# EAGLE board 68030-TK-V09g (EAGLE 6.6.0), part 1 of 2
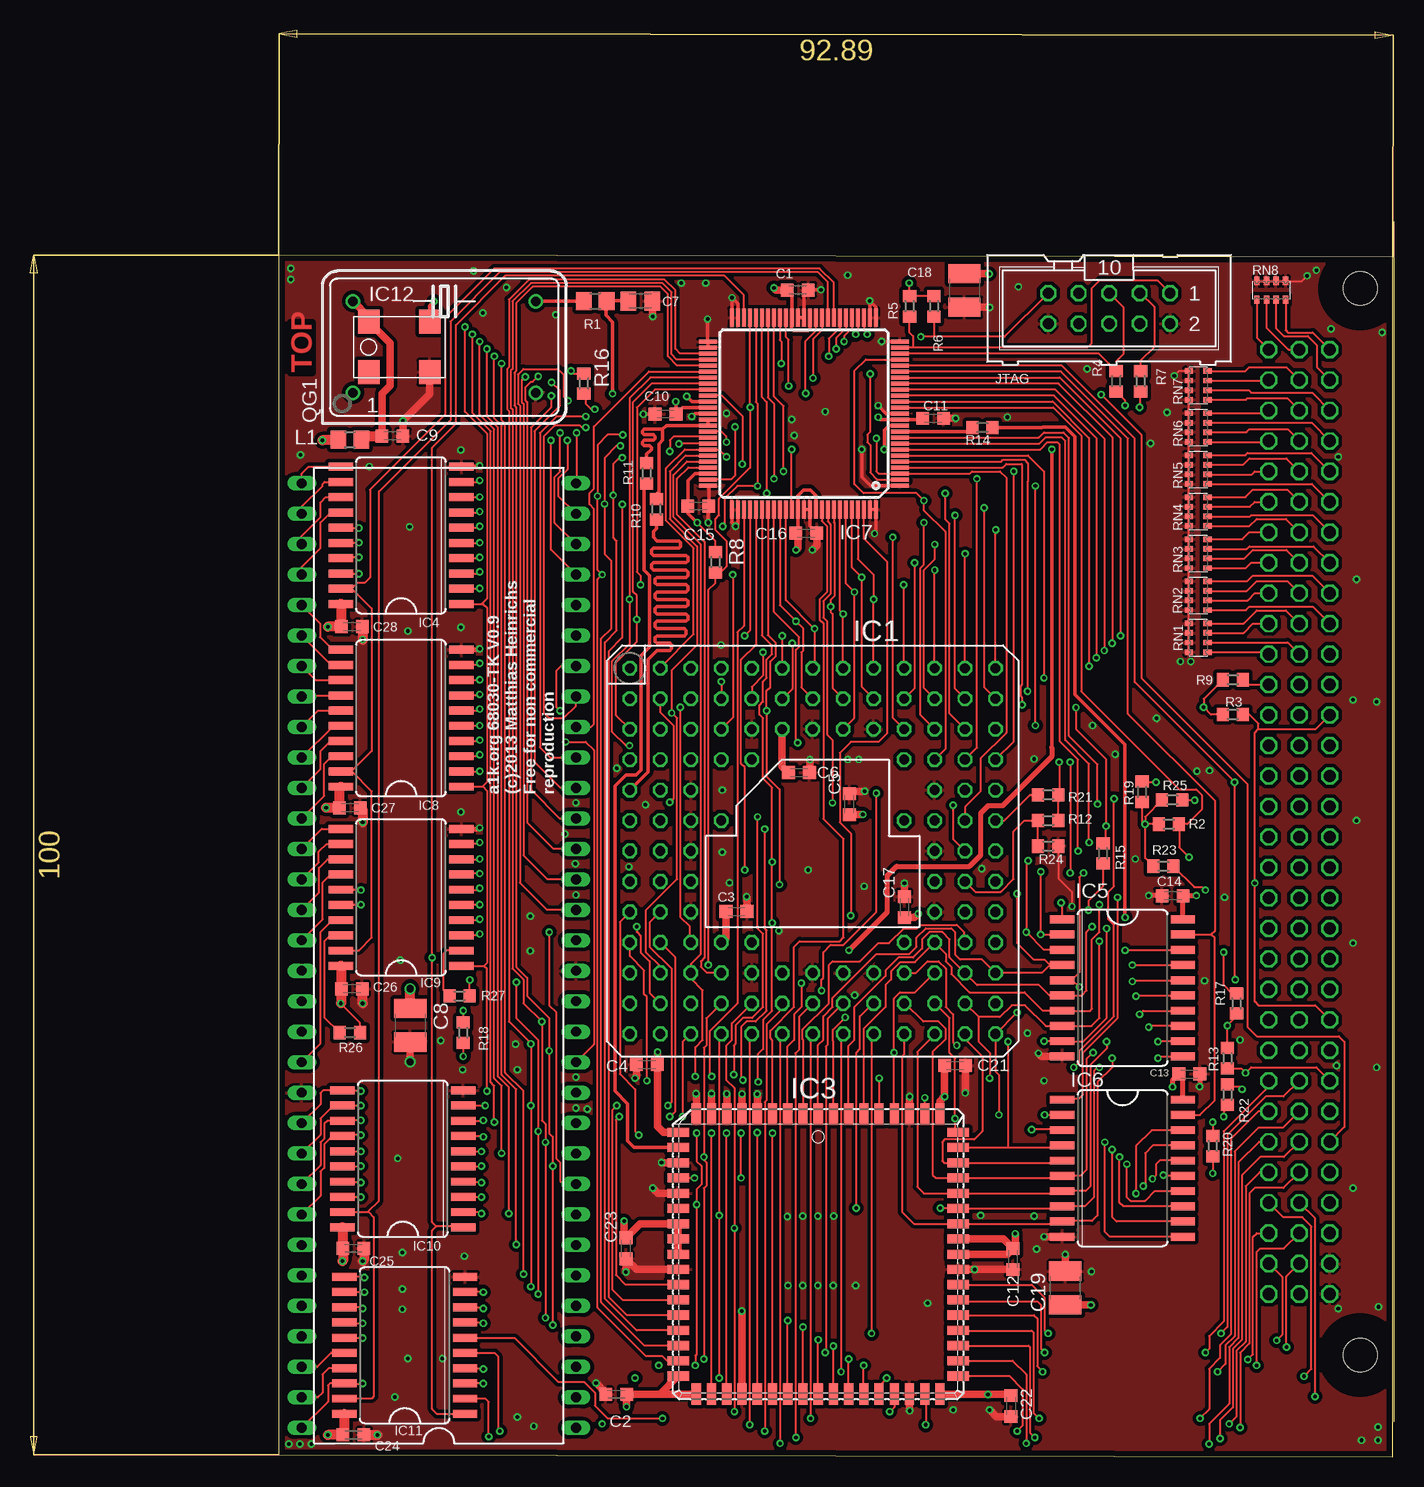
[diagram p3: board, top side]
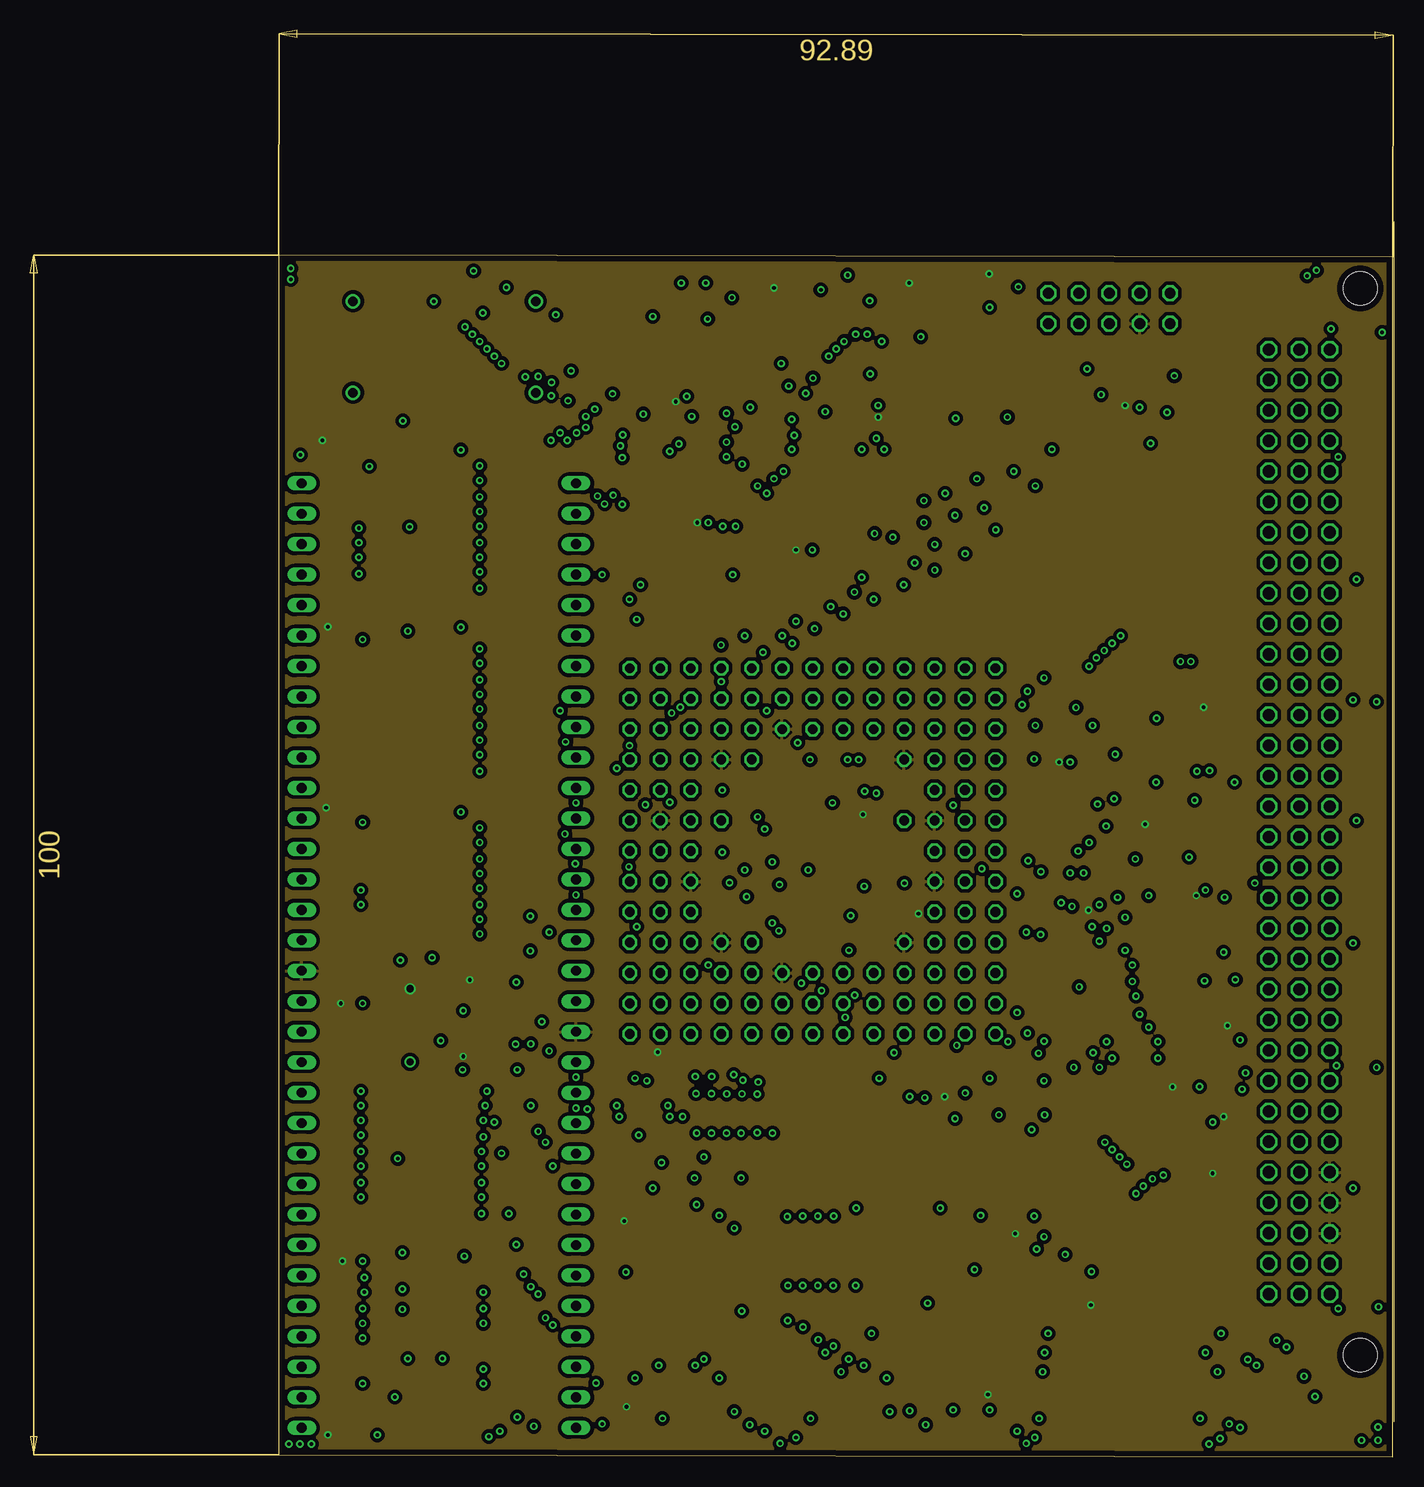
[diagram p4: board, inner layer Route2]
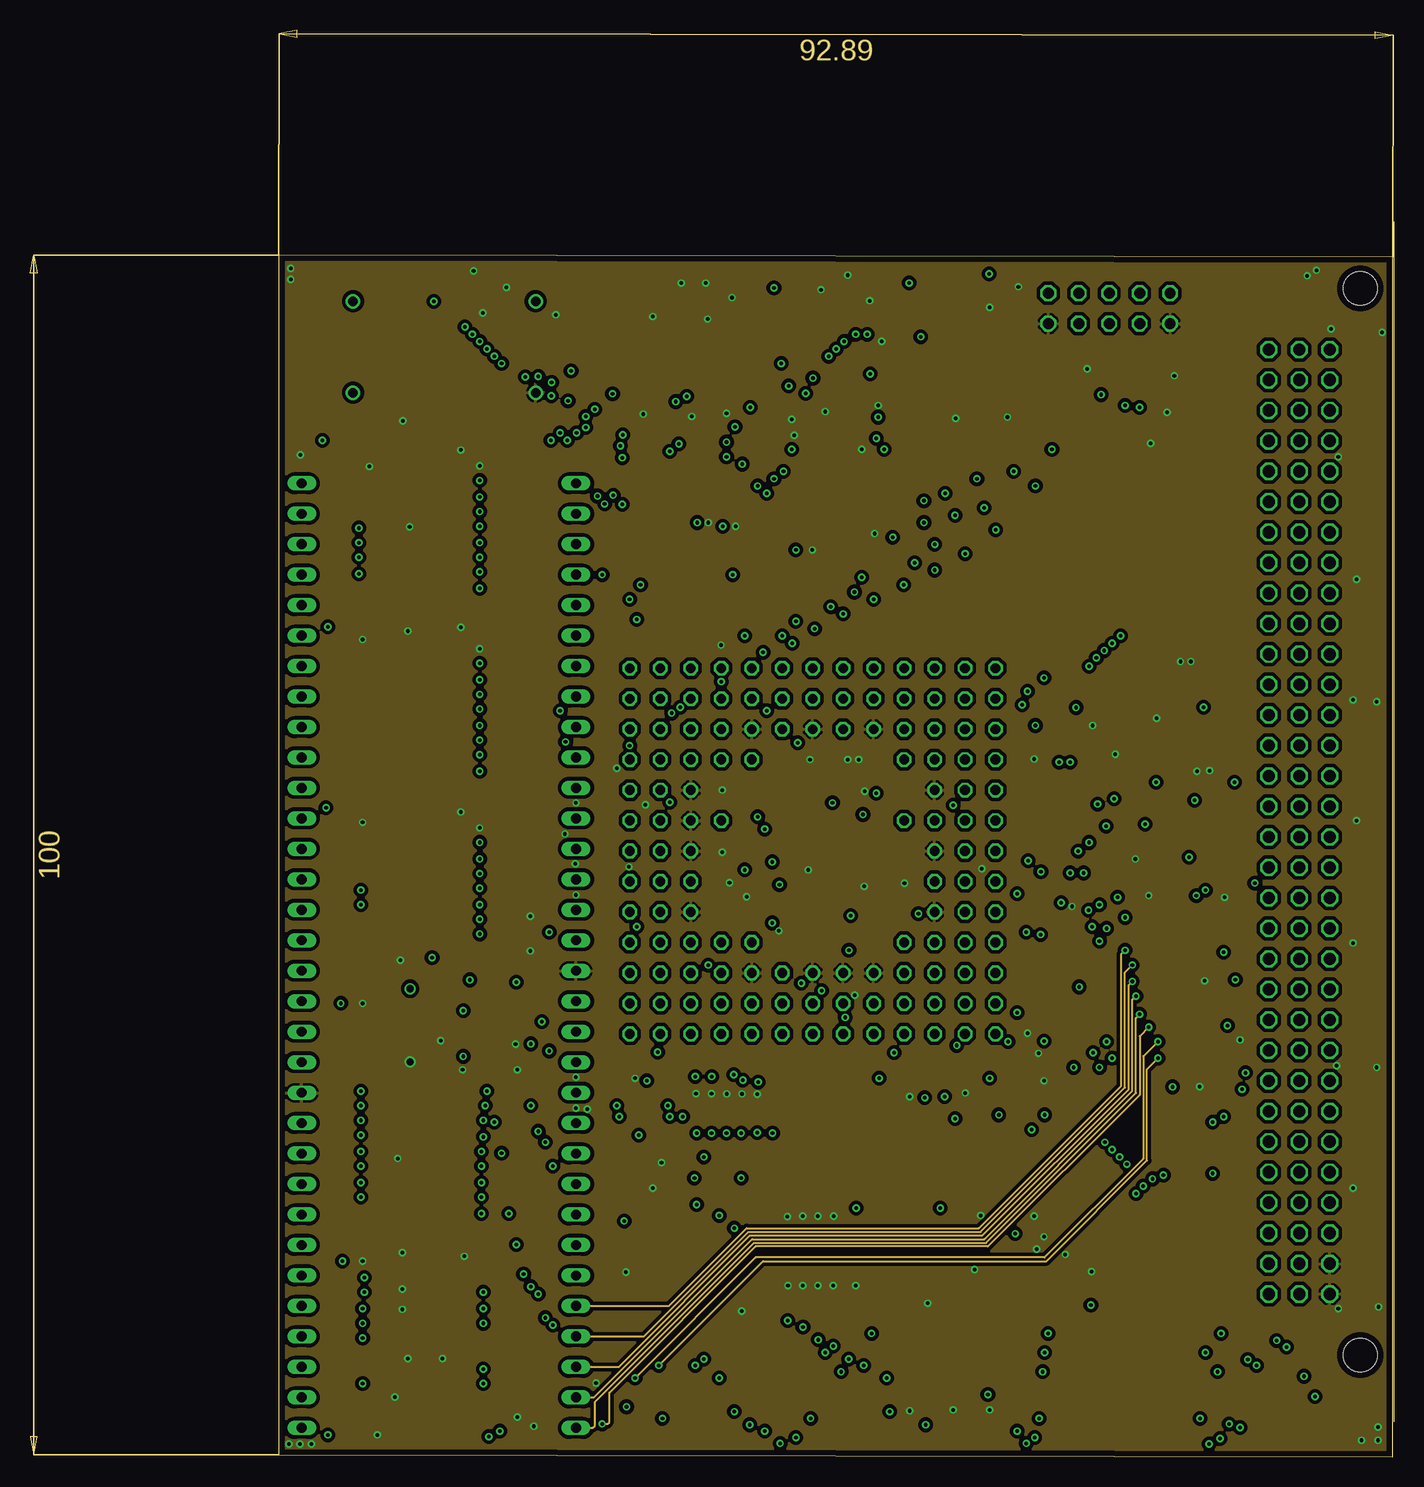
[diagram p5: board, inner layer Route15]
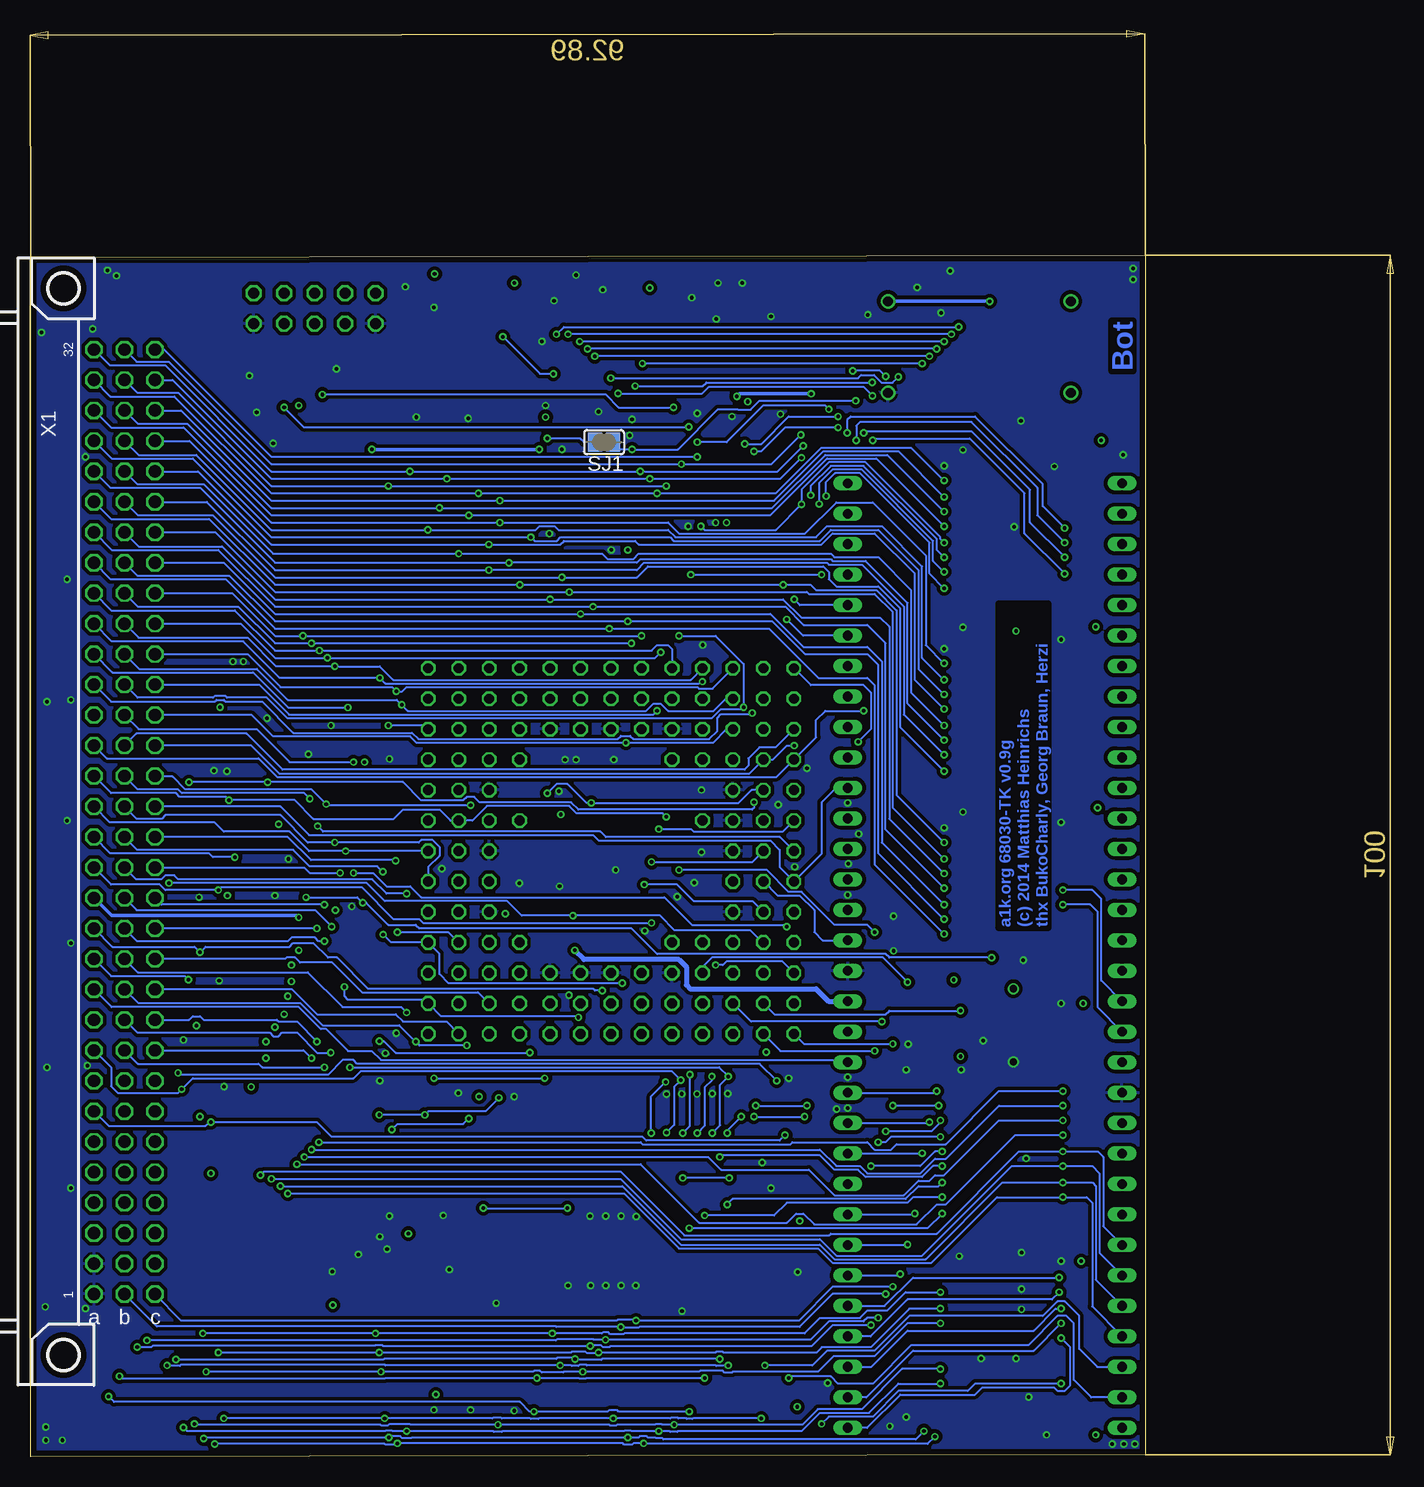
[diagram p6: board, bottom side, seen from below]

Size 92.89 x 100.15 mm. Coordinates in mm from the lower left corner, seen from the top.
Outline: 0,0.15 92.89,0 92.89,100 0,100.15 0,0.15
Copper layers (1+2*15+16): Top 0.035mm / dielectric 0.36mm / Route2 0.035mm / dielectric 0.71mm / Route15 0.035mm / dielectric 0.36mm / Bottom 0.035mm
Design rules "Eagle-DRU - 1203 - LeitOn - 04 layers *": minimum track width 6mil, minimum drill 0.3mm, track to track 6mil, track to pad 6mil, pad to pad 6mil, via to via 6mil, smd to smd 6mil, copper to edge 20mil, drill to drill 10mil, minimum pad ring 8mil, minimum via ring 6mil, stop-mask expansion 3mil, vias tented up to drill 12mil, thermal gap 8mil

## Footprints (pad centres in the part's own frame; a part is rotated, then mirrored left to right if it is on the bottom)
C0603K = smd 1.05 x 1.08: 1 -0.875,0; 2 0.875,0
C0805K = smd 1.3 x 1.6: 1 -1,0; 2 1,0
C1210 = smd 1.6 x 2.7: 1 -1.4,0; 2 1.4,0
MPGA128 = drill 0.813 octagon: A01 -15.24,15.24; A02 -12.7,15.24; A03 -10.16,15.24; A04 -7.62,15.24; A05 -5.08,15.24; A06 -2.54,15.24; A07 0,15.24; A08 2.54,15.24; A09 5.08,15.24; A10 7.62,15.24; A11 10.16,15.24; A12 12.7,15.24; A13 15.24,15.24; B01 -15.24,12.7; B02 -12.7,12.7; B03 -10.16,12.7; B04 -7.62,12.7; B05 -5.08,12.7; B06 -2.54,12.7; B07 0,12.7; B08 2.54,12.7; B09 5.08,12.7; B10 7.62,12.7; B11 10.16,12.7; B12 12.7,12.7; B13 15.24,12.7; C01 -15.24,10.16; C02 -12.7,10.16; C03 -10.16,10.16; C04 -7.62,10.16; C05 -5.08,10.16; C06 -2.54,10.16; C07 0,10.16; C08 2.54,10.16; C09 5.08,10.16; C10 7.62,10.16; C11 10.16,10.16; C12 12.7,10.16; C13 15.24,10.16; D01 -15.24,7.62; D02 -12.7,7.62; D03 -10.16,7.62; D04 -7.62,7.62; D05 -5.08,7.62; D10 7.62,7.62; D11 10.16,7.62; D12 12.7,7.62; D13 15.24,7.62; E01 -15.24,5.08; E02 -12.7,5.08; E03 -10.16,5.08; E11 10.16,5.08; E12 12.7,5.08; E13 15.24,5.08; F01 -15.24,2.54; F02 -12.7,2.54; F03 -10.16,2.54; F04 -7.62,2.54; F10 7.62,2.54; F11 10.16,2.54; F12 12.7,2.54; F13 15.24,2.54; G01 -15.24,0; G02 -12.7,0; G03 -10.16,0; G11 10.16,0; G12 12.7,0; G13 15.24,0; H01 -15.24,-2.54; H02 -12.7,-2.54; H03 -10.16,-2.54; H11 10.16,-2.54; H12 12.7,-2.54; H13 15.24,-2.54; J01 -15.24,-5.08; J02 -12.7,-5.08; J03 -10.16,-5.08; J11 10.16,-5.08; J12 12.7,-5.08; J13 15.24,-5.08; K01 -15.24,-7.62; K02 -12.7,-7.62; K03 -10.16,-7.62; K04 -7.62,-7.62; K05 -5.08,-7.62; K10 7.62,-7.62; K11 10.16,-7.62; K12 12.7,-7.62; K13 15.24,-7.62; L01 -15.24,-10.16; L02 -12.7,-10.16; L03 -10.16,-10.16; L04 -7.62,-10.16; L05 -5.08,-10.16; L06 -2.54,-10.16; L07 0,-10.16; L08 2.54,-10.16; L09 5.08,-10.16; L10 7.62,-10.16; L11 10.16,-10.16; L12 12.7,-10.16; L13 15.24,-10.16; M01 -15.24,-12.7; M02 -12.7,-12.7; M03 -10.16,-12.7; M04 -7.62,-12.7; M05 -5.08,-12.7; M06 -2.54,-12.7; M07 0,-12.7; M08 2.54,-12.7; M09 5.08,-12.7; M10 7.62,-12.7; M11 10.16,-12.7; M12 12.7,-12.7; M13 15.24,-12.7; N01 -15.24,-15.24; N02 -12.7,-15.24; N03 -10.16,-15.24; N04 -7.62,-15.24; N05 -5.08,-15.24; N06 -2.54,-15.24; N07 0,-15.24; N08 2.54,-15.24; N09 5.08,-15.24; N10 7.62,-15.24; N11 10.16,-15.24; N12 12.7,-15.24; N13 15.24,-15.24
DIL64 = drill 0.813 long: 1 -39.37,-11.43; 2 -36.83,-11.43; 3 -34.29,-11.43; 4 -31.75,-11.43; 5 -29.21,-11.43; 6 -26.67,-11.43; 7 -24.13,-11.43; 8 -21.59,-11.43; 9 -19.05,-11.43; 10 -16.51,-11.43; 11 -13.97,-11.43; 12 -11.43,-11.43; 13 -8.89,-11.43; 14 -6.35,-11.43; 15 -3.81,-11.43; 16 -1.27,-11.43; 17 1.27,-11.43; 18 3.81,-11.43; 19 6.35,-11.43; 20 8.89,-11.43; 21 11.43,-11.43; 22 13.97,-11.43; 23 16.51,-11.43; 24 19.05,-11.43; 25 21.59,-11.43; 26 24.13,-11.43; 27 26.67,-11.43; 28 29.21,-11.43; 29 31.75,-11.43; 30 34.29,-11.43; 31 36.83,-11.43; 32 39.37,-11.43; 33 39.37,11.43; 34 36.83,11.43; 35 34.29,11.43; 36 31.75,11.43; 37 29.21,11.43; 38 26.67,11.43; 39 24.13,11.43; 40 21.59,11.43; 41 19.05,11.43; 42 16.51,11.43; 43 13.97,11.43; 44 11.43,11.43; 45 8.89,11.43; 46 6.35,11.43; 47 3.81,11.43; 48 1.27,11.43; 49 -1.27,11.43; 50 -3.81,11.43; 51 -6.35,11.43; 52 -8.89,11.43; 53 -11.43,11.43; 54 -13.97,11.43; 55 -16.51,11.43; 56 -19.05,11.43; 57 -21.59,11.43; 58 -24.13,11.43; 59 -26.67,11.43; 60 -29.21,11.43; 61 -31.75,11.43; 62 -34.29,11.43; 63 -36.83,11.43; 64 -39.37,11.43
PLCC68 = smd 0.76 x 1.8: 1 0,11.67; 2 -1.27,11.67; 3 -2.54,11.67; 4 -3.81,11.67; 5 -5.08,11.67; 6 -6.35,11.67; 7 -7.62,11.67; 8 -8.89,11.67; 9 -10.16,11.67; 27 -10.16,-11.67; 28 -8.89,-11.67; 29 -7.62,-11.67; 30 -6.35,-11.67; 31 -5.08,-11.67; 32 -3.81,-11.67; 33 -2.54,-11.67; 34 -1.27,-11.67; 35 0,-11.67; 36 1.27,-11.67; 37 2.54,-11.67; 38 3.81,-11.67; 39 5.08,-11.67; 40 6.35,-11.67; 41 7.62,-11.67; 42 8.89,-11.67; 43 10.16,-11.67; 61 10.16,11.67; 62 8.89,11.67; 63 7.62,11.67; 64 6.35,11.67; 65 5.08,11.67; 66 3.81,11.67; 67 2.54,11.67; 68 1.27,11.67 | smd 1.8 x 0.76: 10 -11.67,10.16; 11 -11.67,8.89; 12 -11.67,7.62; 13 -11.67,6.35; 14 -11.67,5.08; 15 -11.67,3.81; 16 -11.67,2.54; 17 -11.67,1.27; 18 -11.67,0; 19 -11.67,-1.27; 20 -11.67,-2.54; 21 -11.67,-3.81; 22 -11.67,-5.08; 23 -11.67,-6.35; 24 -11.67,-7.62; 25 -11.67,-8.89; 26 -11.67,-10.16; 44 11.67,-10.16; 45 11.67,-8.89; 46 11.67,-7.62; 47 11.67,-6.35; 48 11.67,-5.08; 49 11.67,-3.81; 50 11.67,-2.54; 51 11.67,-1.27; 52 11.67,0; 53 11.67,1.27; 54 11.67,2.54; 55 11.67,3.81; 56 11.67,5.08; 57 11.67,6.35; 58 11.67,7.62; 59 11.67,8.89; 60 11.67,10.16
SO20W = smd 0.66 x 2.032: 1 -5.715,-5.029; 2 -4.445,-5.029; 3 -3.175,-5.029; 4 -1.905,-5.029; 5 -0.635,-5.029; 6 0.635,-5.029; 7 1.905,-5.029; 8 3.175,-5.029; 9 4.445,-5.029; 10 5.715,-5.029; 11 5.715,5.029; 12 4.445,5.029; 13 3.175,5.029; 14 1.905,5.029; 15 0.635,5.029; 16 -0.635,5.029; 17 -1.905,5.029; 18 -3.175,5.029; 19 -4.445,5.029; 20 -5.715,5.029
TQFP100 = smd 1.5 x 0.342: 1 -8,6; 2 -8,5.5; 3 -8,5; 4 -8,4.5; 5 -8,4; 6 -8,3.5; 7 -8,3; 8 -8,2.5; 9 -8,2; 10 -8,1.5; 11 -8,1; 12 -8,0.5; 13 -8,0; 14 -8,-0.5; 15 -8,-1; 16 -8,-1.5; 17 -8,-2; 18 -8,-2.5; 19 -8,-3; 20 -8,-3.5; 21 -8,-4; 22 -8,-4.5; 23 -8,-5; 24 -8,-5.5; 25 -8,-6; 51 8,-6; 52 8,-5.5; 53 8,-5; 54 8,-4.5; 55 8,-4; 56 8,-3.5; 57 8,-3; 58 8,-2.5; 59 8,-2; 60 8,-1.5; 61 8,-1; 62 8,-0.5; 63 8,0; 64 8,0.5; 65 8,1; 66 8,1.5; 67 8,2; 68 8,2.5; 69 8,3; 70 8,3.5; 71 8,4; 72 8,4.5; 73 8,5; 74 8,5.5; 75 8,6 | smd 0.342 x 1.5: 26 -6,-8; 27 -5.5,-8; 28 -5,-8; 29 -4.5,-8; 30 -4,-8; 31 -3.5,-8; 32 -3,-8; 33 -2.5,-8; 34 -2,-8; 35 -1.5,-8; 36 -1,-8; 37 -0.5,-8; 38 0,-8; 39 0.5,-8; 40 1,-8; 41 1.5,-8; 42 2,-8; 43 2.5,-8; 44 3,-8; 45 3.5,-8; 46 4,-8; 47 4.5,-8; 48 5,-8; 49 5.5,-8; 50 6,-8; 76 6,8; 77 5.5,8; 78 5,8; 79 4.5,8; 80 4,8; 81 3.5,8; 82 3,8; 83 2.5,8; 84 2,8; 85 1.5,8; 86 1,8; 87 0.5,8; 88 0,8; 89 -0.5,8; 90 -1,8; 91 -1.5,8; 92 -2,8; 93 -2.5,8; 94 -3,8; 95 -3.5,8; 96 -4,8; 97 -4.5,8; 98 -5,8; 99 -5.5,8; 100 -6,8
7X5 = smd 1.8 x 2: P$1 -2.54,-2.1; P$2 2.54,-2.1; P$3 2.54,2.1; P$4 -2.54,2.1
R0805 = smd 1.3 x 1.5: 1 -0.95,0; 2 0.95,0
DIL14S = drill 0.813: 1 -7.62,-3.81; 7 7.62,-3.81; 8 7.62,3.81; 14 -7.62,3.81
R0603 = smd 1 x 1.1: 1 -0.85,0; 2 0.85,0
EXBV8V = smd 0.45 x 0.7: 1 -1.2,-0.775; 2 -0.4,-0.775; 3 0.4,-0.775; 4 1.2,-0.775; 5 1.2,0.775; 6 0.4,0.775; 7 -0.4,0.775; 8 -1.2,0.775
SJ = smd 1.168 x 1.6: 1 -0.762,0; 2 0.762,0
ML10 = drill 0.914 octagon: 1 -5.08,-1.27; 2 -5.08,1.27; 3 -2.54,-1.27; 4 -2.54,1.27; 5 0,-1.27; 6 0,1.27; 7 2.54,-1.27; 8 2.54,1.27; 9 5.08,-1.27; 10 5.08,1.27
FABC96R = drill 1.016 octagon: A1 -2.54,39.37; A2 -2.54,36.83; A3 -2.54,34.29; A4 -2.54,31.75; A5 -2.54,29.21; A6 -2.54,26.67; A7 -2.54,24.13; A8 -2.54,21.59; A9 -2.54,19.05; A10 -2.54,16.51; A11 -2.54,13.97; A12 -2.54,11.43; A13 -2.54,8.89; A14 -2.54,6.35; A15 -2.54,3.81; A16 -2.54,1.27; A17 -2.54,-1.27; A18 -2.54,-3.81; A19 -2.54,-6.35; A20 -2.54,-8.89; A21 -2.54,-11.43; A22 -2.54,-13.97; A23 -2.54,-16.51; A24 -2.54,-19.05; A25 -2.54,-21.59; A26 -2.54,-24.13; A27 -2.54,-26.67; A28 -2.54,-29.21; A29 -2.54,-31.75; A30 -2.54,-34.29; A31 -2.54,-36.83; A32 -2.54,-39.37; B1 -5.08,39.37; B2 -5.08,36.83; B3 -5.08,34.29; B4 -5.08,31.75; B5 -5.08,29.21; B6 -5.08,26.67; B7 -5.08,24.13; B8 -5.08,21.59; B9 -5.08,19.05; B10 -5.08,16.51; B11 -5.08,13.97; B12 -5.08,11.43; B13 -5.08,8.89; B14 -5.08,6.35; B15 -5.08,3.81; B16 -5.08,1.27; B17 -5.08,-1.27; B18 -5.08,-3.81; B19 -5.08,-6.35; B20 -5.08,-8.89; B21 -5.08,-11.43; B22 -5.08,-13.97; B23 -5.08,-16.51; B24 -5.08,-19.05; B25 -5.08,-21.59; B26 -5.08,-24.13; B27 -5.08,-26.67; B28 -5.08,-29.21; B29 -5.08,-31.75; B30 -5.08,-34.29; B31 -5.08,-36.83; B32 -5.08,-39.37; C1 -7.62,39.37; C2 -7.62,36.83; C3 -7.62,34.29; C4 -7.62,31.75; C5 -7.62,29.21; C6 -7.62,26.67; C7 -7.62,24.13; C8 -7.62,21.59; C9 -7.62,19.05; C10 -7.62,16.51; C11 -7.62,13.97; C12 -7.62,11.43; C13 -7.62,8.89; C14 -7.62,6.35; C15 -7.62,3.81; C16 -7.62,1.27; C17 -7.62,-1.27; C18 -7.62,-3.81; C19 -7.62,-6.35; C20 -7.62,-8.89; C21 -7.62,-11.43; C22 -7.62,-13.97; C23 -7.62,-16.51; C24 -7.62,-19.05; C25 -7.62,-21.59; C26 -7.62,-24.13; C27 -7.62,-26.67; C28 -7.62,-29.21; C29 -7.62,-31.75; C30 -7.62,-34.29; C31 -7.62,-36.83; C32 -7.62,-39.37 | hole 2.794: 0,-44.456; 0,44.456

## Placement (x,y rotation side)
C1  100nF  [C0603K]  43.28,97.26 0 top
C2  100nF  [C0603K]  28.14,5.21 180 top
C3  100nF  [C0603K]  38.18,45.44 0 top
C4  100nF  [C0603K]  30.71,32.69 180 top
C5  100nF  [C0603K]  47.57,54.41 90 top
C6  100nF  [C0603K]  43.38,57.02 0 top
C7  n.b.  [C0805K]  30.15,96.34 0 top
C8  10µF  [C1210]  10.97,35.97 270 top
C9  100nF  [C0603K]  9.5,85.09 0 top
C10  100nF  [C0603K]  32.26,86.92 180 top
C11  100nF  [C0603K]  54.56,86.56 0 top
C12  100nF  [C0603K]  61.21,16.48 270 top
C13  100nF  [C0603K]  75.92,31.9 0 top
C14  100nF  [C0603K]  74.52,46.76 180 top
C15  100nF  [C0603K]  35,79.25 0 top
C16  100nF  [C0603K]  43.99,76.99 0 top
C17  100nF  [C0603K]  52.17,45.82 90 top
C18  10µF  [C1210]  57.18,97.23 270 top
C19  10µF  [C1210]  65.58,14.07 90 top
C21  100nF  [C0603K]  56.39,32.61 0 top
C22  100nF  [C0603K]  61.06,4.22 270 top
C23  100nF  [C0603K]  28.96,17.37 270 top
C24  100nF  [C0603K]  6.25,1.83 0 top
C25  100nF  [C0603K]  6.25,17.37 0 top
C26  100nF  [C0603K]  6.1,39.01 0 top
C27  100nF  [C0603K]  5.94,54.1 0 top
C28  100nF  [C0603K]  6.1,69.19 0 top
IC1  [MPGA128]  44.53,50.49 0 top
IC2  [DIL64]  13.36,41.78 90 top
IC3  [PLCC68]  44.98,16.89 0 top
IC4  74HCT245DW  [SO20W]  10.21,76.81 90 top
IC5  74HCT245DW  [SO20W]  70.36,39.09 270 top
IC6  74HCT245DW  [SO20W]  70.36,24.05 270 top
IC7  [TQFP100]  43.79,86.97 180 top
IC8  74HCT245DW  [SO20W]  10.21,61.57 90 top
IC9  74HCT245DW  [SO20W]  10.21,46.63 90 top
IC10  74HCT245DW  [SO20W]  10.36,24.84 90 top
IC11  74HCT245DW  [SO20W]  10.52,9.3 90 top
IC12  100Mhz  [7X5]  10.06,92.51 0 top
L1  [R0805]  5.94,84.78 0 top
QG1  100Mhz  [DIL14S]  13.82,92.51 0 top
R1  10  [R0805]  26.39,96.34 0 top
R2  4,7k  [R0603]  74.22,52.73 180 top
R3  4,7k  [R0603]  79.55,61.87 0 top
R4  4,7k  [R0603]  69.82,89.66 270 top
R5  4,7k  [R0603]  52.6,95.91 90 top
R6  4,7k  [R0603]  54.64,95.91 90 top
R7  47  [R0603]  71.86,89.66 270 top
R8  4,7k  [R0603]  36.42,74.57 270 top
R9  4,7k  [R0603]  79.55,64.77 0 top
R10  47  [R0603]  31.5,78.97 270 top
R11  47  [R0603]  30.68,81.97 270 top
R12  4,7k  [R0603]  64.16,53.03 0 top
R13  4,7k  [R0603]  79.1,33.22 90 top
R14  47  [R0603]  58.67,85.8 180 top
R15  4,7k  [R0603]  68.73,50.29 270 top
R16  47  [R0603]  25.45,89.46 90 top
R17  4,7k  [R0603]  79.86,37.79 90 top
R18  4,7k  [R0603]  15.39,35.36 90 top
R19  4,7k  [R0603]  71.98,55.42 90 top
R20  4,7k  [R0603]  77.88,25.91 270 top
R21  4,7k  [R0603]  64.16,55.17 0 top
R22  4,7k  [R0603]  79.1,30.17 90 top
R23  4,7k  [R0603]  73.76,49.22 0 top
R24  4,7k  [R0603]  64.16,50.9 0 top
R25  4,7k  [R0603]  74.5,54.76 0 top
R26  4,7K  [R0603]  5.94,35.36 0 top
R27  4,7K  [R0603]  15.09,38.4 180 top
RN1  4,7k  [EXBV8V]  76.66,68.27 90 top
RN2  4,7k  [EXBV8V]  76.66,71.78 90 top
RN3  4,7k  [EXBV8V]  76.66,75.29 90 top
RN4  4,7k  [EXBV8V]  76.66,78.79 90 top
RN5  4,7k  [EXBV8V]  76.66,82.3 90 top
RN6  4,7k  [EXBV8V]  76.66,85.8 90 top
RN7  4,7k  [EXBV8V]  76.66,89.31 90 top
RN8  4,7k  [EXBV8V]  82.75,97.23 0 top
SJ1  [SJ]  45.11,84.58 180 bottom
SV1  [ML10]  69.24,95.73 180 top
X1  FABC96R  [FABC96R]  90.17,52.93 180 bottom

## Tracks (layer width: path | path; a pad name or v marks a point on that pad's centre or on a via)
!FPU_SENSE
  Top 0.152: IC3.4 41.17,34.72 41,34.9 41,35.51 42.98,37.49 42.98,42.52 43.43,42.98 46.79,42.98 47.09,43.28 47.09,51.51 45.41,53.19 45.41,69.49 45.11,69.8 45.11,71.47 45.72,72.09 45.72,77.57 45.29,78 IC7.91
A0  (via drill 0.3)
  Top 0.152: IC1.A02 31.83,65.81 34.59,68.58 34.59,75.74 32.31,78.03 32.31,82.4 33.88,83.97 IC7.69 36.73,83.97 v37.34,83.36 37.08,83.62 | RN8.1 81.55,93.3 X1.C32
  Bottom 0.152: X1.C32 81.79,92.3 72.85,83.36 v37.34,83.36
A1  (via drill 0.3)
  Top 0.152: v38.66,82.75 38.66,86.77 36.96,88.47 IC7.60 | v37.87,73.53 37.87,61.62 IC1.C04 | v28.7,85.19 27.43,85.19 26.59,84.35 v26.59,80.09 26.59,73.91 v26.98,73.53 26.59,73.15 26.59,12.42 30.63,8.38 32,8.38 32.38,8 IC3.25 | IC4.2 16.74,72.36 v16.76,72.39 | RN8.2 82.35,94.13 84.18,92.3 X1.B32
  Bottom 0.152: X1.B32 84.07,91.29 81.38,91.29 72.85,82.75 v38.66,82.75 31.14,82.75 v28.7,85.19 | v37.87,73.53 v26.98,73.53 | v16.76,72.39 17.98,73.61 17.98,76.2 23.77,81.99 25.86,81.99 26.59,81.25 v26.59,80.09
A2  (via drill 0.3)
  Top 0.152: v61.29,82.14 61.29,59.64 IC1.D13 | IC3.24 30.5,9.27 26.9,12.88 26.9,68.2 27.74,69.04 27.74,74.68 27.18,75.23 v27.18,79.42 27.18,83.26 28.19,84.28 v28.5,84.28 | v42.09,82.14 42.09,87.6 41.3,88.39 41.3,94.96 IC7.43 | IC4.3 16.64,73.63 v16.76,73.76 | RN8.4 83.95,93.9 84.12,93.73 86.21,93.73 X1.A32
  Bottom 0.152: X1.A32 86.31,90.98 81.69,90.98 72.85,82.14 v61.29,82.14 v42.09,82.14 30.63,82.14 v28.5,84.28 | v16.76,73.76 17.68,74.68 17.68,76.35 23.62,82.3 26.06,82.3 27.18,81.18 v27.18,79.42
A3  (via drill 0.3)
  Top 0.152: IC3.23 29.84,10.54 27.2,13.18 27.2,67.89 28.19,68.88 28.19,76.35 27.89,76.66 v27.89,80.16 27.89,82.75 28.42,83.29 v28.65,83.29 | IC1.D12 58.22,59.11 v58.22,81.53 | IC7.44 40.79,88.29 41.3,87.78 v41.3,81.53 | IC4.4 16.69,74.9 v16.76,74.98 | RN7.3 82.49,89.71 X1.C31
  Bottom 0.152: X1.C31 81.08,89.76 72.85,81.53 v58.22,81.53 v41.3,81.53 30.4,81.53 v28.65,83.29 | v16.76,74.98 17.37,75.59 17.37,76.5 23.47,82.6 26.21,82.6 27.89,80.92 v27.89,80.16
A4  (via drill 0.3)
  Top 0.152: IC3.22 29.03,11.81 27.51,13.33 27.51,67.13 28.65,68.28 v28.65,79.4 | v63.09,60.96 v63.09,80.92 | IC4.5 16.74,76.17 v16.76,76.2 | IC7.46 39.79,87.92 39.93,87.78 v39.93,80.92 38.25,80.92 37.19,79.86 37.19,77.72 v37.03,77.57 | RN7.4 80.6,90.51 80.92,90.83 84.02,90.83 X1.B31
  Bottom 0.152: X1.B31 84.02,88.7 80.62,88.7 72.85,80.92 v63.09,80.92 v39.93,80.92 | IC1.C13 60.07,60.96 v63.09,60.96 | v16.76,76.2 17.07,76.5 17.07,76.66 23.32,82.91 26.36,82.91 28.65,80.62 v28.65,79.4 30.79,77.27 36.73,77.27 v37.03,77.57
A5  (via drill 0.3)
  Top 0.152: IC1.C12 55.93,61.95 55.93,77.77 55.58,78.13 v55.58,80.31 | v40.69,80.31 40.69,87.93 40.29,88.34 IC7.45 | IC4.9 16.64,81.25 v16.76,81.38 | RN8.3 83.15,94.09 83.82,93.42 85.8,93.42 86.56,92.66 86.56,90.83 X1.A31
  Bottom 0.152: X1.A31 86.26,88.39 80.92,88.39 72.85,80.31 v55.58,80.31 v40.69,80.31 30.79,80.31 26.98,84.12 19.51,84.12 v16.76,81.38
A6  (via drill 0.3)
  Top 0.152: IC1.D11 55.63,59.05 55.63,77.11 55.58,77.11 53.8,78.89 v53.8,79.7 53.19,80.31 48.77,80.31 48.01,81.08 48.01,90.53 48.95,91.47 IC7.22 | IC4.8 16.74,79.98 v16.76,80.01 | RN6.4 82.33,87 X1.C30
  Bottom 0.152: X1.C30 80.37,87.22 72.85,79.7 v53.8,79.7 30.94,79.7 26.82,83.82 20.57,83.82 v16.76,80.01
A7  (via drill 0.3)
  Top 0.152: IC1.B13 58.83,64.13 v58.83,79.09 | IC4.7 16.69,78.71 v16.76,78.79 | X1.B30 84.07,88.24 80.77,88.24 80.64,88.11 RN7.1
  Bottom 0.152: X1.B30 83.97,86.11 79.86,86.11 72.85,79.09 v58.83,79.09 31.09,79.09 26.67,83.52 21.49,83.52 v16.76,78.79
A8  (via drill 0.3)
  Top 0.152: IC1.B12 56.39,64.03 v56.39,78.49 | IC4.6 16.64,77.44 v16.76,77.57 | RN7.2 80.87,88.91 81.08,88.7 86.16,88.7 X1.A30
  Bottom 0.152: X1.A30 86.21,85.8 80.16,85.8 72.85,78.49 v56.39,78.49 31.24,78.49 26.52,83.21 22.4,83.21 v16.76,77.57
A9  (via drill 0.3)
  Top 0.152: IC1.C11 53.49,61.85 53.49,74.07 53.8,74.37 v53.8,77.88 | v16.76,66.14 16.64,66.01 IC8.9 | RN6.1 82.47,84.6 X1.C29
  Bottom 0.152: X1.C29 79.65,84.68 72.85,77.88 v53.8,77.88 39.78,77.88 38.86,76.96 28.35,76.96 25.76,79.55 22.71,79.55 18.29,75.13 18.29,67.67 v16.76,66.14
A10  (via drill 0.3)
  Top 0.152: IC1.A13 59.77,77.24 v59.79,77.27 | IC8.8 16.74,64.74 v16.76,64.77 | RN6.2 80.68,85.4 80.92,85.65 84.12,85.65 X1.B29
  Bottom 0.152: X1.B29 83.92,83.52 79.1,83.52 72.85,77.27 v59.79,77.27 50.8,77.27 50.49,77.57 49.23,77.57 48.92,77.27 39.78,77.27 39.17,76.66 27.43,76.66 26.52,77.57 21.95,77.57 18.59,74.22 18.59,66.6 v16.76,64.77
A11  (via drill 0.3)
  Top 0.152: IC1.C10 51.21,61.59 v51.21,76.66 | v16.76,63.55 16.69,63.47 IC8.7 | RN6.3 86.11,86.2 X1.A29
  Bottom 0.152: X1.A29 86.16,83.21 79.4,83.21 72.85,76.66 v51.21,76.66 50.9,76.35 49.02,76.35 48.72,76.66 39.62,76.66 39.32,76.35 27.13,76.35 26.21,77.27 22.25,77.27 18.9,73.91 18.9,65.68 v16.76,63.55
A12  (via drill 0.3)
  Top 0.152: IC1.B11 53.8,64.08 53.8,73.91 54.71,74.83 v54.71,76.05 | IC8.6 16.64,62.2 v16.76,62.33 | RN5.2 81.13,81.9 81.38,82.14 X1.C28
  Bottom 0.152: X1.C28 78.94,82.14 72.85,76.05 v54.71,76.05 48.77,76.05 48.46,76.35 42.52,76.35 42.22,76.05 26.98,76.05 26.06,76.96 22.55,76.96 19.2,73.61 19.2,64.77 v16.76,62.33
A13  (via drill 0.3)
  Top 0.152: IC1.A12 v57.23,75.28 | v16.76,60.96 16.74,60.93 IC8.5 | RN5.3 80.41,82.7 80.92,83.21 84.02,83.21 X1.B28
  Bottom 0.152: X1.B28 84.02,81.08 78.49,81.08 72.69,75.28 v57.23,75.28 45.26,75.28 44.81,74.83 42.67,74.83 42.22,75.28 26.21,75.28 25.91,74.98 22.25,74.98 19.51,72.24 19.51,63.7 v16.76,60.96
A14  (via drill 0.3)
  Top 0.152: IC1.B10 53.03,64.08 v53.03,74.52 | IC8.4 16.69,59.66 v16.76,59.74 | RN5.4 80.6,83.5 80.77,83.67 86.11,83.67 X1.A28
  Bottom 0.152: X1.A28 86.26,80.77 78.79,80.77 72.54,74.52 v53.03,74.52 42.37,74.52 42.06,74.83 26.21,74.83 26.06,74.68 23.32,74.68 19.81,71.17 19.81,62.79 v16.76,59.74
A15  (via drill 0.3)
  Top 0.152: IC1.A11 54.69,73.89 v54.71,73.91 | v16.76,58.52 16.64,58.39 IC8.3 | RN4.3 80.97,79.19 81.38,79.6 X1.C27
  Bottom 0.152: X1.C27 78.23,79.6 72.54,73.91 v54.71,73.91 42.37,73.91 41.76,74.52 26.52,74.52 26.36,74.37 23.62,74.37 20.12,70.87 20.12,61.87 v16.76,58.52
A16  (via drill 0.3)
  Top 0.152: IC1.B09 48.62,64.19 v48.62,73.3 47.79,74.13 IC7.96 | IC8.2 16.74,57.12 v16.76,57.15 | RN4.4 80.6,79.99 81.23,80.62 84.07,80.62 X1.B27
  Bottom 0.152: X1.B27 83.97,78.49 77.72,78.49 72.54,73.3 v48.62,73.3 42.37,73.3 41.45,74.22 26.82,74.22 26.36,73.76 26.36,73.15 25.76,72.54 22.25,72.54 20.42,70.71 20.42,60.81 v16.76,57.15
A17  (via drill 0.3)
  Top 0.152: IC1.A10 52.12,65.76 v52.12,72.69 | IC7.59 31.36,88.97 29.87,87.48 29.87,73.76 30.18,73.46 v30.18,72.69 | v16.76,51.21 16.64,51.08 IC9.9 | RN5.1 86.14,81.1 X1.A27
  Bottom 0.152: X1.A27 86.21,78.18 78.03,78.18 72.54,72.69 v52.12,72.69 v30.18,72.69 27.89,72.69 27.43,72.24 22.4,72.24 20.73,70.56 20.73,55.17 v16.76,51.21
A18  (via drill 0.3)
  Top 0.152: IC1.C08 48.01,61.59 v48.01,72.09 47.29,72.8 IC7.95 | IC9.8 16.74,49.81 v16.76,49.83 | RN3.4 80.35,76.48 80.92,77.06 X1.C26
  Bottom 0.152: X1.C26 77.52,77.06 72.54,72.09 v48.01,72.09 28.19,72.09 28.04,71.93 22.55,71.93 21.03,70.41 21.03,54.1 v16.76,49.83
A19  (via drill 0.3)
  Top 0.152: IC1.A09 v49.61,71.47 49.61,73.53 48.29,74.85 IC7.97 | v16.76,48.62 15.32,48.62 IC9.7 | RN4.1 80.94,77.59 81.53,78.18 83.97,78.18 X1.B26
  Bottom 0.152: X1.B26 83.92,75.89 76.96,75.89 72.54,71.47 v49.61,71.47 30.18,71.47 28.65,69.95 22.1,69.95 21.34,69.19 21.34,53.19 v16.76,48.62
A20  (via drill 0.3)
  Top 0.152: IC1.B08 46.18,64.08 46.18,70.26 46.02,70.41 v46.02,70.87 46.02,71.42 46.33,71.73 46.33,77.88 46.29,77.92 IC7.93 | IC9.6 16.64,47.27 v16.76,47.4 | RN4.2 80.98,78.39 81.08,78.49 86.21,78.49 X1.A26
  Bottom 0.152: X1.A26 86.16,75.59 77.27,75.59 72.54,70.87 v46.02,70.87 30,70.87 28.47,69.34 23.16,69.34 21.64,67.82 21.64,52.27 v16.76,47.4
A21  (via drill 0.3)
  Top 0.152: IC1.A08 v47.07,70.26 46.79,70.53 IC7.94 | v16.76,46.02 16.74,46 IC9.5 | RN3.1 80.64,74.09 81.08,74.52 X1.C25
  Bottom 0.152: X1.C25 76.81,74.52 72.54,70.26 v47.07,70.26 31.24,70.26 28.5,67.51 23.16,67.51 21.95,66.29 21.95,51.21 v16.76,46.02
A22  (via drill 0.3)
  Top 0.152: IC9.4 16.69,44.73 v16.76,44.8 | IC1.B07 43.59,64.13 43.59,67.06 43.74,67.21 43.74,69.04 v43.13,69.65 41.79,70.99 IC7.84 | RN3.2 80.52,74.89 81.23,75.59 84.02,75.59 X1.B25
  Bottom 0.152: X1.B25 84.02,73.46 76.35,73.46 72.54,69.65 v43.13,69.65 31.09,69.65 28.35,66.9 23.16,66.9 22.25,65.99 22.25,50.29 v16.76,44.8
A23  (via drill 0.3)
  Top 0.152: v16.76,43.59 16.64,43.46 IC9.3 | IC1.A07 44.68,65.89 v44.68,69.04 44.65,69.04 42.29,71.4 IC7.85 | RN3.3 80.72,75.69 80.92,75.89 86.26,75.89 X1.A25
  Bottom 0.152: X1.A25 86.26,73.15 76.66,73.15 72.54,69.04 v44.68,69.04 31.37,69.04 27.25,64.92 23.16,64.92 22.55,64.31 22.55,49.38 v16.76,43.59
A24  (via drill 0.3)
  Top 0.152: v41.99,68.43 IC1.A06 | IC7.19 65.12,89.97 70.21,84.89 v70.21,68.43 | RN2.2 80.78,71.38 81.38,71.98 X1.C24
  Bottom 0.152: X1.C24 76.1,71.98 72.54,68.43 v70.21,68.43 v41.99,68.43
A25  (via drill 0.3)
  Top 0.152: v42.82,67.82 42.82,64.01 42.01,63.2 IC1.B06 | IC7.18 65.01,89.47 69.49,84.99 v69.49,67.82 | RN2.3 80.72,72.18 81.53,73 84.07,73 X1.B24
  Bottom 0.152: X1.B24 83.97,70.87 75.59,70.87 72.54,67.82 v69.49,67.82 v42.82,67.82
A26  (via drill 0.3)
  Top 0.152: IC7.17 64.75,88.97 68.83,84.89 v68.83,67.21 | RN2.4 80.75,72.98 81.23,73.46 86.16,73.46 X1.A24
  Bottom 0.152: X1.A24 86.21,70.56 75.89,70.56 72.54,67.21 v68.83,67.21 41.15,67.21 40.69,67.67 39.78,67.67 39.45,67.34 IC1.A05
A27  (via drill 0.3)
  Top 0.152: v40.39,67.06 40.39,65.12 39.45,64.19 IC1.B05 | IC7.16 64.64,88.47 68.17,84.94 v68.17,66.6 | RN1.3 80.46,68.67 81.23,69.44 X1.C23
  Bottom 0.152: X1.C23 75.39,69.44 72.54,66.6 v68.17,66.6 40.84,66.6 v40.39,67.06
A28  (via drill 0.3)
  Top 0.152: IC7.15 64.53,87.97 67.56,84.94 v67.56,65.89 | RN1.4 80.45,69.47 81.53,70.56 83.97,70.56 X1.B23
  Bottom 0.152: X1.B23 83.92,68.28 74.83,68.28 72.44,65.89 v67.56,65.89 63.8,65.89 62.69,64.77 37.87,64.77 IC1.A04
A29  (via drill 0.3)
  Top 0.152: v36.91,64.62 IC1.B04 | IC7.6 62.48,83.47 63.8,82.14 v63.8,64.92 | RN2.1 80.64,70.58 80.92,70.87 86.21,70.87 X1.A23
  Bottom 0.152: X1.A23 86.16,67.97 75.18,67.97 72.14,64.92 v63.8,64.92 63.35,64.47 37.19,64.47 37.03,64.62 v36.91,64.62
A30  (via drill 0.3)
  Top 0.152: IC7.5 60.26,82.97 60.4,83.11 62.18,83.11 62.48,82.8 62.48,81.33 62.43,81.28 v62.43,63.8 | RN1.1 82.38,67.08 X1.C22
  Bottom 0.152: X1.C22 74.83,66.9 72.08,64.16 62.79,64.16 v62.43,63.8 61.92,63.8 61.57,64.16 37.34,64.16 37.21,64.03 36.07,64.03 IC1.A03
A31  (via drill 0.3)
  Top 0.152: IC7.4 60.37,82.47 60.66,82.75 61.92,82.75 61.98,82.7 61.98,64.36 61.82,64.21 61.82,63.45 61.98,63.3 v61.98,62.69 | RN1.2 84.12,67.88 X1.B22
  Bottom 0.152: X1.B22 83.87,65.68 74.07,65.68 71.48,63.09 62.38,63.09 v61.98,62.69 61.47,62.18 41.6,62.18 41,62.79 40.39,62.79 39.78,62.18 35.97,62.18 34.95,63.2 IC1.B03
AMIGA_A1  (via drill 0.3)
  Top 0.152: IC2.29 22.71,75.61 v22.71,84.73 | IC4.18 5.21,73.61 v6.71,73.61
  Bottom 0.152: v22.71,84.73 22.55,84.89 14.63,84.89 10.06,80.31 10.06,76.96 v6.71,73.61
AMIGA_A2  (via drill 0.3)
  Top 0.152: IC2.30 23.01,77.85 23.01,81.69 23.47,82.14 v23.47,85.34 | IC4.17 5.26,74.98 v6.71,74.98
  Bottom 0.152: v23.47,85.34 23.32,85.5 14.48,85.5 9.6,80.62 9.6,77.88 v6.71,74.98
AMIGA_A3  (via drill 0.3)
  Top 0.152: IC2.31 23.32,80.09 23.32,81.53 24.08,82.3 v24.08,84.73 | IC4.16 5.21,76.2 v6.71,76.2
  Bottom 0.152: v6.71,76.2 8.99,78.49 8.99,80.77 14.48,86.26 23.77,86.26 24.08,85.95 v24.08,84.73
AMIGA_A4  (via drill 0.3)
  Top 0.152: IC4.15 5.21,77.42 v6.71,77.42 | v24.84,85.34 24.84,81.2 IC2.32
  Bottom 0.152: v6.71,77.42 8.53,79.25 8.53,81.08 14.17,86.72 24.54,86.72 24.84,86.41 v24.84,85.34
AMIGA_A5
  Top 0.152: IC2.33 1.93,81.94 2.52,82.52 IC4.11
AMIGA_A6
  Top 0.152: IC2.34 1.93,79.2 3.66,80.92 3.66,81.08 3.83,81.25 IC4.12
AMIGA_A7
  Top 0.152: IC2.35 1.93,76.76 3.5,78.33 3.5,79.55 3.94,79.98 IC4.13
AMIGA_A8
  Top 0.152: IC2.36 1.93,74.17 3.5,75.74 3.5,77.88 4.34,78.71 IC4.14
AMIGA_A9
  Top 0.152: IC2.37 3.45,69.47 3.45,68.33 4.5,67.28 IC8.11
AMIGA_A10
  Top 0.152: IC2.38 4.37,66.01 IC8.12
AMIGA_A11
  Top 0.152: IC2.39 3.1,64.74 IC8.13
AMIGA_A12
  Top 0.152: IC2.40 2.03,63.47 IC8.14
AMIGA_A13
  Top 0.152: IC2.41 3.3,62.2 IC8.15
AMIGA_A14
  Top 0.152: IC2.42 4.57,60.93 IC8.16
AMIGA_A15
  Top 0.152: IC2.43 3.5,57.33 3.5,58.83 4.34,59.66 IC8.17
AMIGA_A16
  Top 0.152: IC2.44 3.81,55.09 3.81,57.76 4.45,58.39 IC8.18
AMIGA_A17
  Top 0.152: IC2.45 3.61,52.35 IC9.11
AMIGA_A18
  Top 0.152: IC2.46 3.35,49.55 3.35,50.44 3.99,51.08 IC9.12
AMIGA_A19
  Top 0.152: IC2.47 3.38,47.04 3.38,49.1 4.09,49.81 IC9.13
AMIGA_A20
  Top 0.152: IC2.48 3.68,44.8 3.68,47.88 4.34,48.54 IC9.14
AMIGA_A21  (via drill 0.3)
  Top 0.152: v6.86,47.24 6.83,47.27 IC9.15
  Bottom 0.152: IC2.50 3.66,39.7 3.66,46.48 4.42,47.24 v6.86,47.24
AMIGA_A22  (via drill 0.3)
  Top 0.152: v6.86,46.02 6.83,46 IC9.16
  Bottom 0.152: IC2.51 3.96,37.47 3.96,45.41 4.57,46.02 v6.86,46.02
AMIGA_A23
  Top 0.152: IC2.52 3.5,34.47 3.5,43.74 4.5,44.73 IC9.17
AMIGA_ADR_ENABLE
  Top 0.152: IC4.19 5.21,72.39 6.1,72.39 | IC8.19 5.21,57.15 6.1,57.15 | IC9.19 5.21,42.21 6.71,42.21 7.77,43.28 7.77,55.47 6.1,57.15 | IC7.33 46.29,97.88 45.11,99.06 17.98,99.06 13.87,94.95 13.87,86.87 7.62,80.62 7.62,73.3 7.16,72.85 6.55,72.85 6.1,72.39 | 6.1,72.39 7.77,70.71 7.77,58.83 6.1,57.15
AMIGA_BUS_EN_LOW
  Top 0.152: IC6.19 76.81,28.5 78.03,29.72 78.03,43.28 77.78,43.54 | IC7.20 65.23,90.47 70.81,84.89 70.81,61.93 78.03,54.71 78.03,43.79 77.78,43.54 | IC5.19 77.78,43.54
AMIGA_BUS_ENABLE_HIGH
  Top 0.152: IC7.34 45.79,97.92 44.96,98.75 18.44,98.75 14.33,94.64 14.33,86.41 8.38,80.47 8.38,21.34 7.44,20.4 | IC11.19 7.75,4.85 7.92,5.03 7.92,19.96 7.49,20.4 7.44,20.4 | IC10.19 7.44,20.4
AMIGA_D0  (via drill 0.3)
  Top 0.152: v7.16,14.93 7.09,15.01 IC11.11 | v70.56,42.21 70.61,42.27 IC5.18
  Route15 0.152: IC2.5 32.54,12.57 39.01,19.05 58.37,19.05 70.26,30.94 70.26,41.91 v70.56,42.21
  Bottom 0.152: IC2.5 21.72,12.57 19.36,14.93 v7.16,14.93
AMIGA_D1  (via drill 0.3)
  Top 0.152: IC11.12 7.14,13.74 v7.16,13.72 | v71.17,41 IC5.17
  Route15 0.152: IC2.4 30.45,10.03 39.17,18.75 58.52,18.75 70.56,30.78 70.56,40.39 v71.17,41
  Bottom 0.152: v7.16,13.72 7.77,13.11 19.81,13.11 22.89,10.03 IC2.4
AMIGA_D2  (via drill 0.3)
  Top 0.152: v7.01,12.34 6.88,12.47 IC11.13 | v71.17,39.62 71.27,39.73 IC5.16
  Route15 0.152: IC2.3 28.37,7.49 39.32,18.44 58.67,18.44 70.87,30.63 70.87,39.32 v71.17,39.62
  Bottom 0.152: IC2.3 22.84,7.49 19.81,10.51 9.3,10.51 7.47,12.34 v7.01,12.34
AMIGA_D3  (via drill 0.3)
  Top 0.152: IC11.14 5.56,11.12 v7.01,11.12 | v71.48,38.4 71.53,38.45 IC5.15
  Route15 0.152: IC2.2 26.29,4.95 39.47,18.14 58.83,18.14 71.17,30.48 71.17,38.1 v71.48,38.4
  Bottom 0.152: IC2.2 23.24,4.95 19.36,8.84 9.3,8.84 v7.01,11.12
AMIGA_D4  (via drill 0.3)
  Top 0.152: IC11.15 6.99,9.93 v7.01,9.91 | v71.78,36.88 72.08,37.19 IC5.14
  Route15 0.152: IC2.1 26.19,2.41 26.36,2.59 26.36,4.57 39.62,17.83 58.98,17.83 71.48,30.33 71.48,36.58 v71.78,36.88
  Bottom 0.152: IC2.1 23.19,2.41 20.42,5.18 14.17,5.18 13.56,5.79 7.62,5.79 7.32,5.49 6.71,5.49 6.25,5.94 6.25,9.14 v7.01,9.91
AMIGA_D5  (via drill 0.3)
  Top 0.152: IC2.64 4.12,4.6 4.12,5.94 4.29,6.12 IC11.18 5.51,6.1 v7.01,6.1 | IC5.13 72.64,35.91 v72.54,35.81
  Route15 0.152: v72.54,35.81 71.78,35.05 71.78,30.18 59.13,17.53 39.78,17.53 27.58,5.33 27.58,2.9 27.43,2.74 v26.98,2.74
  Bottom 0.152: v7.01,6.1 14.17,6.1 14.78,5.49 20.57,5.49 22.71,3.35 26.36,3.35 v26.98,2.74
AMIGA_D6  (via drill 0.3)
  Top 0.152: IC11.17 4.19,7.39 3.66,6.86 3.66,5.33 3.28,4.95 IC2.63 | IC5.12 73.36,34.65 v73.3,34.59
  Route15 0.152: v73.3,34.59 72.08,33.38 72.08,24.84 63.86,16.61 39.78,16.61 v29.72,6.55
  Bottom 0.152: IC2.63 4.5,4.95 5.94,6.4 5.94,11.12 6.55,11.73 7.32,11.73 9.75,9.3 19.51,9.3 22.71,6.1 25.6,6.1 26.21,6.71 29.57,6.71 v29.72,6.55
AMIGA_D7  (via drill 0.3)
  Top 0.152: IC11.16 4.39,8.66 3.23,7.49 IC2.62 | v73.3,33.22 73.46,33.38 IC5.11
  Route15 0.152: v31.7,7.62 40.39,16.31 64.01,16.31 72.39,24.69 72.39,32.31 v73.3,33.22
  Bottom 0.152: IC2.62 3.99,7.49 5.49,8.99 5.49,11.73 6.71,12.95 7.32,12.95 8.53,11.73 19.66,11.73 22.55,8.84 26.52,8.84 27.74,7.62 v31.7,7.62
AMIGA_D8  (via drill 0.3)
  Top 0.152: IC10.18 6.83,21.67 v6.86,21.64 | IC6.18 72.8,27.23 71.48,25.91 v71.48,21.95
  Bottom 0.152: v71.48,21.95 43.43,21.95 38.86,17.37 27.28,17.37 26.06,16.15 17.83,16.15 12.34,21.64 v6.86,21.64 4.88,21.64 4.42,21.18 4.42,12.52 IC2.61
AMIGA_D9  (via drill 0.3)
  Top 0.152: IC10.17 6.78,22.94 v6.86,22.86 | IC6.17 72.9,25.96 72.24,25.3 72.24,22.71 v72.08,22.55
  Bottom 0.152: IC2.60 4.12,14.76 4.12,22.55 4.42,22.86 v6.86,22.86 11.89,22.86 18.29,16.46 25.91,16.46 27.13,17.68 38.71,17.68 43.59,22.55 v72.08,22.55
AMIGA_D10  (via drill 0.3)
  Top 0.152: IC10.16 6.83,24.21 v6.86,24.23 | IC6.16 73.46,24.69 73.15,24.38 73.15,23.47 v72.85,23.16
  Bottom 0.152: IC2.59 3.81,16.99 3.81,23.62 4.42,24.23 v6.86,24.23 11.12,24.23 18.59,16.76 25.76,16.76 27.13,18.14 38.71,18.14 43.74,23.16 v72.85,23.16
AMIGA_D11  (via drill 0.3)
  Top 0.152: IC10.15 6.83,25.48 v6.86,25.45 | IC6.15 73.81,23.42 v73.76,23.47
  Bottom 0.152: IC2.58 3.5,19.23 3.5,24.99 3.96,25.45 v6.86,25.45 10.52,25.45 17.37,18.59 26.21,18.59 26.36,18.44 38.41,18.44 43.74,23.77 73.46,23.77 v73.76,23.47
AMIGA_D12  (via drill 0.3)
  Top 0.152: IC2.57 3.5,21.77 3.5,23.77 3.81,24.08 3.81,26.06 4.5,26.75 IC10.14 5.41,26.82 v6.86,26.82 | v70.71,24.38 70.71,21.64 71.02,21.34 72.24,21.34 73.05,22.15 IC6.14
  Bottom 0.152: v70.71,24.38 42.06,24.38 37.19,19.51 29.87,19.51 29.11,20.27 28.5,20.27 27.58,19.35 19.05,19.35 17.37,21.03 16.61,21.03 10.82,26.82 v6.86,26.82
AMIGA_D13  (via drill 0.3)
  Top 0.152: IC2.56 3.5,24.31 3.5,26.21 3.81,26.52 3.81,27.74 4.09,28.02 IC10.13 5.36,28.04 v6.86,28.04 | IC6.13 70.41,20.88 70.1,21.18 v70.1,24.99
  Bottom 0.152: v70.1,24.99 36.42,24.99 35.36,23.93 28.04,23.93 25.91,21.79 20.12,21.79 18.9,23.01 17.98,23.01 17.53,23.47 16.76,23.47 12.19,28.04 v6.86,28.04
AMIGA_D14  (via drill 0.3)
  Top 0.152: IC2.55 3.5,26.85 3.5,28.19 4.6,29.29 IC10.12 5.36,29.26 v6.86,29.26 | IC6.12 69.85,19.61 69.49,19.96 v69.49,25.6
  Bottom 0.152: v69.49,25.6 27.13,25.6 25.76,24.23 23.77,24.23 23.16,23.62 18.75,23.62 17.53,24.84 16.61,24.84 12.19,29.26 v6.86,29.26
AMIGA_D15  (via drill 0.3)
  Top 0.152: IC2.54 3.5,29.39 3.5,30.33 3.73,30.56 IC10.11 5.41,30.48 v6.86,30.48 | IC6.11 69.29,18.34 68.89,18.75 v68.89,26.21
  Bottom 0.152: v6.86,30.48 12.19,30.48 16.61,26.06 20.73,26.06 21.18,25.6 22.55,25.6 23.16,26.21 29.41,26.21 29.57,26.06 41.91,26.06 42.06,26.21 v68.89,26.21
AMIGA_DATA_DIR  (via drill 0.3)
  Top 0.152: IC7.48 38.79,96.85 37.19,98.45 18.9,98.45 14.78,94.34 14.78,86.11 12.8,84.12 v12.8,41.61 12.8,19.54 13.14,19.2 | 13.14,19.2 15.32,19.2 IC10.1 | IC11.1 13.18,3.58 12.8,3.96 12.8,18.86 13.14,19.2 | IC5.1 65.33,46.08 v65.23,46.18 | IC6.1 65.43,29.87 66.75,29.87 67.06,30.18 67.06,33.68 69.95,36.58 v69.95,46.63
  Bottom 0.152: v69.95,46.63 65.68,46.63 v65.23,46.18 64.92,46.18 63.09,44.35 60.81,44.35 60.5,44.04 42.82,44.04 40.69,41.91 21.64,41.91 21.34,41.61 v12.8,41.61
AS_00  (via drill 0.3)
  Top 0.152: v20.42,15.24 20.42,30.48 18.9,32 18.9,86.11 18.59,86.41 v18.59,91.14 | IC7.42 41.79,93.08 41.91,92.96 v41.91,91.14
  Bottom 0.152: IC2.6 20.55,15.11 v20.42,15.24 | v18.59,91.14 v41.91,91.14
AS_30  (via drill 0.3)
  Top 0.152: IC1.J02 30.94,44.53 30.94,42.52 32.77,40.69 32.77,29.57 v32.46,29.26 | v41.76,47.7 41.76,55.63 40.69,56.69 v40.69,62.18 40.69,63.86 41,64.16 41,66.29 41.45,66.75 41.45,67.82 40.79,68.48 IC7.82 | v28.19,29.26 27.81,28.88 27.81,13.94 28.68,13.08 IC3.21 | R9.2 80.81,64.36 X1.C21
  Bottom 0.152: X1.C21 73.86,64.36 71.37,61.87 41,61.87 v40.69,62.18 | v32.46,29.26 v28.19,29.26 | IC1.J02 32.74,46.33 37.64,46.33 39.01,47.7 v41.76,47.7
AVEC  (via drill 0.3)
  Top 0.152: v45.26,38.86 45.26,39.78 45.41,39.93 45.41,42.06 46.02,42.67 47.09,42.67 49.84,45.41 v49.84,55.32 | R17.2 79.47,38.65 78.79,39.32 v78.79,42.06 | IC7.92 45.79,77.96 46.02,77.72 46.02,71.93 45.41,71.32 45.41,69.95 45.72,69.65 45.72,60.2 46.18,59.74 v46.18,54.51
  Bottom 0.152: IC1.E02 32.82,55.58 33.88,54.51 v46.18,54.51 46.58,54.51 48.16,56.08 49.07,56.08 v49.84,55.32 | X1.A13 86.11,42.52 79.25,42.52 v78.79,42.06 78.33,42.52 71.32,42.52 71.02,42.82 69.34,42.82 68.12,41.61 67.36,41.61 64.77,39.01 46.02,39.01 45.87,38.86 v45.26,38.86
BERR  (via drill 0.3)
  Top 0.152: IC2.22 23.5,55.75 21.34,57.91 21.34,85.5 23.42,87.58 23.42,88.9 v22.76,89.56 | v42.52,89.25 42.52,93.12 42.29,93.35 IC7.41
  Bottom 0.152: v42.52,89.25 36.88,89.25 36.58,89.56 v22.76,89.56 | IC2.22 25.78,55.75 26.98,54.56 26.98,50.27 IC1.H01 30.48,49.15 30.48,50.6 31.24,51.36 45.57,51.36 46.02,51.82 69.7,51.82 72.08,54.2 X1.C17
BG_00  (via drill 0.3)
  Top 0.152: v17.98,27.89 17.98,30.94 17.68,31.24 17.68,85.5 16.15,87.02 v16.15,93.57 | IC7.29 48.29,93.75 v48.11,93.57
  Bottom 0.152: IC2.11 18.06,27.81 v17.98,27.89 | v16.15,93.57 v48.11,93.57
BG_30  (via drill 0.3)
  Top 0.152: v79.76,39.78 79.7,39.83 v79.7,56.23 71.37,64.57 71.37,84.89 65.29,90.97 IC7.21 | v32.61,54.56 32.92,54.86 32.92,60.96 31.83,62.05 IC1.B02 | R19.2 72.02,56.23 v73.15,56.23
  Bottom 0.152: X1.A12 86.21,40.08 80.06,40.08 v79.76,39.78 | v32.61,54.56 32.61,54.1 32.77,53.95 47.24,53.95 47.85,54.56 55.47,54.56 55.93,55.02 56.54,55.02 56.84,54.71 60.35,54.71 61.87,56.23 v73.15,56.23 v79.7,56.23
BGACK_00  (via drill 0.3)
  Top 0.152: v17.37,30.48 17.37,40.69 17.14,40.92 | IC4.1 16.92,71.09 | 16.92,71.09 17.06,71.09 17.37,70.78 17.37,56.23 17.04,55.9 17.04,55.85 | v15.54,94.18 15.54,87.12 17.37,85.29 17.37,71.55 16.92,71.09 | IC7.28 48.79,93.86 v49.07,93.57 | IC8.1 17.04,55.85 | IC9.1 17.14,40.92 | 17.04,55.85 17.37,55.52 17.37,41.15 17.14,40.92
  Bottom 0.152: IC2.12 17.5,30.35 v17.37,30.48 | v49.07,93.57 48.46,94.18 v15.54,94.18
BGACK_30  (via drill 0.3)
  Top 0.152: v43.28,59.51 43.13,59.66 43.13,67.26 43.38,67.51 43.38,68.33 41.29,70.42 IC7.83
  Bottom 0.152: IC1.C03 34.9,60.66 36.04,59.51 v43.28,59.51 60.73,59.51 61.27,60.05 72.69,60.05 74.47,61.82 X1.C20
BR_30  (via drill 0.3)
  Top 0.152: v23.93,59.59 25.6,59.59 26.29,58.9 26.29,34.39 IC2.13
  Bottom 0.152: IC1.A01 27.86,64.31 23.47,64.31 22.86,63.7 22.86,60.66 v23.93,59.59 | X1.A11 86.16,37.49 70.56,37.49 68.73,35.66 68.28,35.66 66.45,33.83 64.47,33.83 63.7,33.07 24.97,33.07 IC2.13
CBACK  (via drill 0.3)
  Top 0.152: v77.88,27.89 R20.1 | IC1.J01 28.45,44.58 28.45,31.9 29.72,30.63 29.72,27.13 v30.02,26.82
  Bottom 0.152: X1.A7 86.41,27.58 78.33,27.58 78.03,27.89 v77.88,27.89 69.04,27.89 67.82,26.67 41.91,26.67 41.6,26.37 30.48,26.37 v30.02,26.82
CBREQ  (via drill 0.3)
  Top 0.152: R13.1 80.25,32.37 v80.62,32 81.08,32.46 86.51,32.46 X1.A8 | v30.71,31.34 30.71,38.33 30.48,38.56 30.48,40.54 29.29,41.73 IC1.K01
  Bottom 0.152: v30.71,31.34 32.13,32.77 65.68,32.77 65.99,33.07 66.9,33.07 68.12,31.85 80.47,31.85 v80.62,32
CDIS
  Top 0.152: IC1.H12 58.09,47.09 60.2,47.09 61.27,48.16 61.27,52.12 62.18,53.04 R12.1 R24.1
CIIN  (via drill 0.3)
  Top 0.152: v35.81,41 35.81,72.24 36.42,72.85 R8.2 36.46,73.76 36.88,73.76 37.34,74.22 37.34,76.35 36.42,77.27 36.42,78.18 36.73,78.49 36.73,79.86 39.32,82.45 v39.32,87.48 39.32,94.94 IC7.47 | X1.A6 88.85,27.48 88.85,34.59 88.39,35.05 81.53,35.05 80.77,35.81 80.77,56.08 71.93,64.92 71.93,85.19 v68.58,88.54
  Bottom 0.152: v68.58,88.54 44.96,88.54 43.89,87.48 v39.32,87.48 | IC1.L01 30.25,41.3 34.9,41.3 35.2,41 v35.81,41
CLK_00  (via drill 0.3)
  Top 0.305: 64.47,59.13 v64.47,83.97 | v50.49,83.97 50.49,85.6 50.87,85.97 IC7.11
  Top 0.406: 64.47,59.13 64.47,58.37 60.35,54.25 59.13,54.25 58.52,53.64 58.52,50.14 57.61,49.23 51.51,49.23 50.75,48.46 50.75,45.41 v47.55,42.21
  Bottom 0.305: v64.47,83.97 v50.49,83.97
  Bottom 0.406: IC2.15 26.39,37.97 27.43,39.01 37.95,39.01 38.25,39.32 38.25,40.84 38.86,41.45 46.79,41.45 v47.55,42.21
CLK_30
  Top 0.305: R10.2 31.5,77.37 31.24,77.11 31.24,76.66 31.55,76.35 33.38,76.35 33.53,76.2 33.53,75.89 33.38,75.74 31.24,75.74 31.09,75.59 31.09,75.28 31.24,75.13 33.98,75.13 34.14,74.98 34.14,74.68 33.98,74.52 31.24,74.52 31.09,74.37 31.09,74.07 31.24,73.91 33.98,73.91 34.14,73.76 34.14,73.46 33.98,73.3 31.55,73.3 31.39,73.15 31.39,72.85 31.55,72.69 33.98,72.69 34.14,72.54 34.14,72.24 33.98,72.09 31.55,72.09 31.39,71.93 31.39,71.63 31.55,71.47 33.98,71.47 34.14,71.32 34.14,71.02 33.98,70.87 31.55,70.87 31.39,70.71 31.39,70.41 31.55,70.26 33.98,70.26 34.14,70.1 34.14,69.8 33.98,69.65 31.55,69.65 31.39,69.49 31.39,69.19 31.55,69.04 33.83,69.04 33.98,68.88 33.98,68.58 33.83,68.43 31.55,68.43 31.39,68.28 31.39,67.97 31.55,67.82 32.61,67.82 32.77,67.67 32.77,67.36 32.61,67.21 31.55,67.21 30.79,66.45 30.79,57.07 IC1.E01
CLK_30_CPLD
  Top 0.305: R11.1 30.68,83.57 31.09,83.97 31.09,84.12 30.94,84.28 30.48,84.28 30.33,84.43 30.33,84.58 30.48,84.73 31.24,84.73 31.39,84.89 31.39,85.04 31.24,85.19 30.48,85.19 30.33,85.34 30.33,85.5 30.48,85.65 32,85.65 | R10.1 31.5,80.26 31.7,80.47 31.7,84.43 32,84.73 32,85.65 | 32,85.65 32.33,85.97 IC7.65 IC7.64
CLK_30_FPU
  Top 0.305: IC3.11 29.64,25.78 29.11,26.31 29.11,29.41 28.04,30.48 28.04,55.93 28.96,56.84 29.82,56.84 30.23,57.25 30.23,66.8 30.94,67.51 30.94,73.46 30.48,73.91 30.48,80.91 R11.2
CLK_EXP  (via drill 0.3)
  Top 0.305: v70.56,44.96 70.56,59.38 66.4,63.55 66.4,85.04 65.58,85.85 63.7,85.85 63.65,85.8 R14.1
  Bottom 0.305: X1.A14 86.16,45.11 70.71,45.11 v70.56,44.96
CLK_OSZI  (via drill 0.3)
  Top 0.152: C7.1 | C7.1 29.14,96.37 | R1.2 C7.1 | 27.43,96.37 27.28,96.52
  Top 0.305: 29.14,96.37 27.43,96.37 | IC7.61 34.46,87.97 v34.04,88.39 | 27.28,96.52 27.28,95.15 27.84,94.59 v27.84,88.62
  Bottom 0.305: v27.84,88.62 33.81,88.62 v34.04,88.39
CS_FPU  (via drill 0.3)
  Top 0.152: IC3.29 37.34,5.25 v37.34,26.97 | IC7.78 38.79,69.27 38.25,68.73 38.25,37.8 35.97,35.51 35.97,31.85 v36.12,31.7
  Bottom 0.152: v36.12,31.7 36.12,31.39 36.73,30.78 36.73,27.58 v37.34,26.97
D0  (via drill 0.3)
  Top 0.152: IC5.2 v63.52,43.54 63.52,48.74 v63.55,48.77 | IC3.3 42.44,34.21 42.98,34.75 42.98,36.88 43.59,37.49 v43.59,39.47
  Bottom 0.152: v63.52,43.54 62.87,42.88 IC1.K13 58.83,41.94 58.83,40.23 58.06,39.47 v43.59,39.47 | v63.55,48.77 64.01,49.23 69.65,49.23 71.02,50.6 84.02,50.6 X1.B16
D1  (via drill 0.3)
  Top 0.152: IC5.3 63.8,42.27 v62.33,43.74 62.33,49.53 v62.48,49.68 | IC3.2 43.74,28.59 43.74,34.75 43.69,34.8 43.69,35.61 45.87,37.8 45.87,41 46.18,41.3 48.46,41.3 49.99,42.82 50.9,42.82 52.12,44.04 53.19,44.04 53.49,44.35 56.54,44.35 57.15,43.74 57.15,42.95 IC1.K12
  Bottom 0.152: v62.33,43.74 58.09,43.74 IC1.K12 | v62.48,49.68 62.53,49.73 69.55,49.73 71.48,51.66 X1.C16
D2  (via drill 0.3)
  Top 0.152: IC3.1 44.98,34.31 45.41,34.75 45.41,36.73 46.18,37.49 46.18,38.25 49.84,41.91 52.58,41.91 53.19,42.52 53.19,43.28 53.95,44.04 56.08,44.04 56.39,43.74 56.39,41.88 56.82,41.45 58.65,41.45 IC1.L13 63.65,40.34 64.31,41 | v61.57,46.94 61.57,42.82 62.94,41.45 63.86,41.45 64.31,41 | 64.31,41 IC5.4
  Bottom 0.152: v61.57,46.94 63.25,46.94 64.44,48.13 80.59,48.13 80.92,48.46 81.69,48.46 82.02,48.13 84.1,48.13 X1.B15
D3  (via drill 0.3)
  Top 0.152: IC3.68 46.25,34.65 46.2,34.7 46.2,35.59 v47.24,36.63 | 64.52,39.73 IC5.5 | v67.11,48.67 66.75,48.31 66.75,40.39 66.09,39.73 IC5.5 | v66.75,39.17 66.19,39.73 IC5.5
  Bottom 0.152: X1.C15 70.1,49.12 69.65,48.67 v67.11,48.67 | v47.24,36.63 47.35,36.73 58.67,36.73 59.74,37.8 IC1.M13 60.07,38.1 66.45,38.1 66.75,38.4 v66.75,39.17
D4  (via drill 0.3)
  Top 0.152: v67.82,44.2 67.36,43.74 67.36,38.86 66.95,38.45 IC5.6 64.26,38.45 63.4,39.32 58.22,39.32 57.23,40.31 IC1.L12 55.93,41.63 55.93,43.13 55.32,43.74 54.25,43.74 53.65,43.13 53.65,42.37 52.88,41.61 51.66,41.61 50.6,40.54 50.6,40.08 48.01,37.49 48.01,34.75 47.52,34.26 IC3.67
  Bottom 0.152: X1.B14 84.07,45.57 69.19,45.57 v67.82,44.2
D5  (via drill 0.3)
  Top 0.152: v68.43,46.02 68.43,43.74 67.82,43.13 67.82,37.34 67.67,37.19 IC5.7 63.7,37.19 62.18,38.71 57.61,38.71 56.08,40.23 56.08,40.84 55.63,41.3 55.63,41.94 IC1.K11 53.06,41.25 51.84,41.25 51.05,40.46 51.05,39.78 50.6,39.32 50.6,37.49 48.77,35.66 48.77,28.59 IC3.66
  Bottom 0.152: v68.43,46.02 81.99,46.02 X1.C14
D6  (via drill 0.3)
  Top 0.152: v68.43,42.98 68.43,36.58 67.77,35.91 IC5.8 63.96,35.91 62.23,37.64 61.11,37.64 60.12,36.65 58.37,36.65 | 58.37,36.65 58.37,34.59 59.28,33.68 v59.28,31.55 | 58.37,36.65 IC1.M12 | v50.06,31.55 IC3.65
  Bottom 0.152: v68.43,42.98 68.89,42.98 69.19,43.28 71.17,43.28 71.48,42.98 84.02,42.98 X1.B13 | v59.28,31.55 v50.06,31.55
D7  (via drill 0.3)
  Top 0.152: v69.04,44.04 69.04,36.58 67.11,34.65 IC5.9 v63.83,34.65 | IC3.64 51.33,29.46 51.31,29.49 v51.31,33.68 51.31,38.2 51.82,38.71 53.06,38.71 IC1.L11
  Bottom 0.152: v69.04,44.04 X1.C13 | v63.83,34.65 63.45,34.65 62.48,33.68 v51.31,33.68
D8  (via drill 0.3)
  Top 0.152: IC3.62 v53.87,29.92 | 65.18,28.35 IC6.2 v63.86,28.5 | v60.05,28.5 60.05,31.85 59.77,32.13 IC1.N13 59.79,35.26 v61.57,37.03
  Bottom 0.152: v63.86,28.5 v60.05,28.5 59.74,28.8 54.99,28.8 v53.87,29.92 | X1.B12 83.97,40.39 69.8,40.39 66.9,37.49 62.03,37.49 v61.57,37.03
D9  (via drill 0.3)
  Top 0.152: IC3.60 56.39,27.32 v56.39,28.19 56.39,33.22 55.93,33.68 55.93,36.58 54.71,37.8 IC1.M11 | IC6.3 65.28,27.28 v62.79,27.28
  Bottom 0.152: IC1.M11 54.71,37.8 55.63,38.71 65.28,38.71 67.77,41.2 70.46,41.2 70.87,41.61 71.58,41.61 71.68,41.5 X1.C12 | v62.79,27.28 62.33,27.74 56.84,27.74 v56.39,28.19
D10  (via drill 0.3)
  Top 0.152: IC3.59 60.81,25.78 | 60.81,25.78 65.15,25.78 IC6.4 | v60.81,34.59 60.81,25.78 | IC1.L10 53.14,40.34 54.1,41.3 55.02,41.3 55.63,40.69 55.63,37.49 56.24,36.88 56.24,34.59 v56.54,34.29
  Bottom 0.152: X1.B11 83.92,37.8 70.41,37.8 68.58,35.97 62.18,35.97 v60.81,34.59 60.5,34.29 v56.54,34.29
D11
  Top 0.152: IC6.5 65.15,24.51 IC3.58 55.47,24.51 55.32,24.66 55.32,26.24 55.52,26.44 57.99,26.44 58.67,27.13 58.67,33.38 57.23,34.82 IC1.N12
  Bottom 0.152: IC1.N12 58.24,36.27 61.87,36.27 62.48,36.88 69.04,36.88 71.12,38.96 X1.C11
D12  (via drill 0.3)
  Top 0.152: v67.89,33.68 67.36,33.15 67.36,23.93 66.85,23.42 IC6.6 65.15,23.24 IC3.57 54.79,23.24 54.51,23.52 54.51,33.73 55.63,34.85 55.63,35.66 55.02,36.27 53.75,36.27 52.22,37.8 IC1.M10
  Bottom 0.152: X1.B10 84.02,35.36 73,35.36 72.69,35.05 72.24,35.05 71.93,35.36 70.71,35.36 69.04,33.68 v67.89,33.68
D13  (via drill 0.3)
  Top 0.152: IC1.N11 54.69,35.18 53.24,33.73 53.24,22.5 53.8,21.95 56.63,21.95 IC3.56 65.15,21.97 IC6.7 67.28,22.15 67.67,22.53 67.67,32.66 69.04,34.04 v69.04,34.59
  Bottom 0.152: X1.C10 79.7,36.42 79.4,36.73 78.79,36.73 78.49,36.42 72.39,36.42 72.24,36.27 70.71,36.27 v69.04,34.59
D14  (via drill 0.3)
  Top 0.152: v55.17,20.73 56.63,20.73 IC3.55 65.15,20.7 IC6.8 67.21,20.88 67.97,21.64 67.97,32.16 68.28,32.46 v68.43,32.46 | v48.16,20.73 48.16,33.68 48.46,33.98 48.46,36.73 49.53,37.8 IC1.M09
  Bottom 0.152: v55.17,20.73 v48.16,20.73 | X1.B9 83.97,32.77 73.91,32.77 73.61,32.46 v68.43,32.46
D15  (via drill 0.3)
  Top 0.152: v69.49,33.22 69.49,32.46 68.28,31.24 68.28,20.12 67.82,19.66 65.38,19.66 IC6.9 65.15,19.43 IC3.54 52.96,19.43 51.97,20.42 51.97,33.38 52.15,33.55 IC1.N10
  Bottom 0.152: X1.C9 70.16,33.88 v69.49,33.22
D16  (via drill 0.3)
  Top 0.152: IC3.50 62.79,14.35 63.86,13.28 63.86,10.59 v64.16,10.29 | IC1.N09 49.43,35.08 v49.43,10.29 | v17.07,13.72 17.04,13.74 IC11.9 | X1.B8 83.77,30.02 82.3,30.02 79.1,26.82 79.1,10.82 v78.56,10.29
  Bottom 0.152: v78.56,10.29 v64.16,10.29 v49.43,10.29 45.29,10.29 45.21,10.36 44.76,10.36 44.6,10.21 43.48,10.21 43.41,10.29 28.4,10.29 27.1,11.58 23.77,11.58 23.16,12.19 21.49,12.19 19.96,13.72 v17.07,13.72
D17  (via drill 0.3)
  Top 0.152: IC3.49 56.78,12.95 63.25,12.95 63.55,12.65 63.55,8.99 v63.86,8.69 | IC1.M08 45.77,36.5 45.77,34.34 45.62,34.19 45.62,8.74 v45.57,8.69 | IC11.8 16.94,12.47 v17.07,12.34 | v77.27,8.69 77.57,8.99 77.57,10.06 78.79,11.28 78.79,27.13 82.55,30.89 X1.C8
  Bottom 0.152: v77.27,8.69 v63.86,8.69 47.85,8.69 47.8,8.74 46.63,8.74 46.53,8.64 45.62,8.64 v45.57,8.69 35.81,8.69 35.76,8.74 35.2,8.74 35.15,8.69 27.41,8.69 26.95,9.14 22.86,9.14 19.66,12.34 v17.07,12.34
D18  (via drill 0.3)
  Top 0.152: IC3.48 62.97,11.81 63.25,11.53 63.25,7.54 v63.7,7.09 | IC1.N08 46.89,35.08 v46.89,7.09 | IC11.7 16.99,11.2 v17.07,11.12 | X1.B7 83.72,27.43 81.69,27.43 79.7,25.45 79.7,10.06 78.94,9.3 78.94,7.75 v78.28,7.09
  Bottom 0.152: v78.28,7.09 v63.7,7.09 51,7.09 50.93,7.16 50.44,7.16 50.32,7.04 48.51,7.04 48.46,7.09 v46.89,7.09 37.19,7.09 37.11,7.16 35.2,7.16 35.05,7.01 34.44,7.01 34.37,7.09 27.28,7.09 25.98,8.38 22.55,8.38 19.81,11.12 v17.07,11.12
D19  (via drill 0.3)
  Top 0.152: IC3.47 56.68,10.51 62.79,10.51 62.94,10.36 62.94,3.66 v63.4,3.2 | IC1.N07 44.35,35.08 v44.35,3.2 | IC11.6 15.57,9.91 19.66,9.91 23.32,6.25 25.45,6.25 26.36,5.33 26.36,4.27 27.43,3.2 v32,3.2 | X1.C7 81.69,28.8 79.4,26.52 79.4,10.21 78.49,9.3 78.49,8.23 77.57,7.32 77.57,3.96 v76.81,3.2
  Bottom 0.152: v32,3.2 37.69,3.2 37.74,3.15 38.2,3.15 38.25,3.2 38.91,3.2 38.96,3.25 39.52,3.25 39.57,3.2 v44.35,3.2 50.55,3.2 50.6,3.15 51.21,3.15 51.26,3.2 53.65,3.2 53.7,3.25 54.36,3.25 54.41,3.2 v63.4,3.2 v76.81,3.2
D20  (via drill 0.3)
  Top 0.152: IC3.46 62.51,9.27 62.64,9.14 62.64,2.01 v63.04,1.6 | IC1.M07 43.38,36.65 43.38,33.93 43.08,33.63 43.08,1.65 v43.13,1.6 | IC11.5 18.01,8.66 18.29,8.38 18.29,2.29 v18.44,2.13 | X1.B6 83.82,24.99 81.84,24.99 80.31,23.47 80.31,9.75 79.55,8.99 79.55,4.11 78.49,3.05 v78.49,1.52
  Bottom 0.152: v18.44,2.13 19.13,1.45 40.16,1.45 40.26,1.55 40.79,1.55 40.84,1.6 41.43,1.6 41.55,1.73 42.11,1.73 42.24,1.6 v43.13,1.6 61.14,1.6 61.19,1.55 61.92,1.55 62.1,1.73 62.94,1.73 63.04,1.62 v63.04,1.6 78.41,1.6 v78.49,1.52
D21  (via drill 0.3)
  Top 0.152: IC1.N06 41.81,35.08 v41.81,1.12 | IC3.45 61.19,8 62.33,6.86 v62.33,1.12 | v77.57,1.07 77.57,2.74 79.25,4.42 79.25,9.14 80.01,9.91 80.01,24.54 81.74,26.26 X1.C6 | v17.53,1.68 17.53,4.57 17.25,4.85 IC11.2
  Bottom 0.152: v77.57,1.07 63.4,1.07 63.35,1.02 62.43,1.02 v62.33,1.12 43.54,1.12 43.43,1.02 42.77,1.02 42.67,1.12 v41.81,1.12 41.76,1.07 18.14,1.07 v17.53,1.68
D22  (via drill 0.3)
  Top 0.152: v61.57,2.13 62.03,2.59 62.03,5.64 60.94,6.73 IC3.44 | v40.54,2.13 40.54,29.57 40.69,29.72 40.69,36.04 41.99,37.34 IC1.M06 | v17.07,6.1 17.04,6.12 IC11.3 | X1.B5 83.77,22.4 81.38,22.4 80.92,21.95 80.92,9.45 80.16,8.69 v80.16,2.44
  Bottom 0.152: v17.07,6.1 20.57,6.1 23.01,3.66 27.13,3.66 28.65,2.13 38.96,2.13 39.01,2.08 39.57,2.08 39.62,2.13 v40.54,2.13 42.82,2.13 42.88,2.18 43.38,2.18 43.43,2.13 53.59,2.13 53.65,2.08 54.3,2.08 54.36,2.13 v61.57,2.13 62.74,2.13 62.79,2.18 63.3,2.18 63.35,2.13 79.86,2.13 v80.16,2.44
D23  (via drill 0.3)
  Top 0.152: IC3.42 53.95,5.14 v53.95,2.67 | IC1.N05 39.27,35.08 v39.27,2.67 | IC11.4 16.99,7.39 v17.07,7.32 | X1.C5 81.79,23.72 80.62,22.55 80.62,9.6 79.86,8.84 79.86,3.35 v79.25,2.74
  Bottom 0.152: v17.07,7.32 20.27,7.32 23.62,3.96 27.28,3.96 28.57,2.67 v39.27,2.67 40.26,2.67 40.31,2.72 40.82,2.72 40.87,2.67 44.02,2.67 44.09,2.59 44.6,2.59 44.68,2.67 v53.95,2.67 61.24,2.67 61.29,2.72 63.02,2.72 63.14,2.59 63.68,2.59 63.75,2.67 79.17,2.67 v79.25,2.74
D24  (via drill 0.3)
  Top 0.152: IC1.M05 37.8,36.14 37.8,34.75 37.34,34.29 37.34,31.39 38,30.73 v38,19.05 v38,3.76 | IC3.40 51.33,4.14 v50.95,3.76 | IC10.2 16.79,20.4 v16.92,20.27 | v86.41,5.03 86.41,19.86 X1.B4
  Bottom 0.152: v38,3.76 43.89,3.76 43.99,3.86 44.7,3.86 44.81,3.76 v50.95,3.76 51.31,3.76 52.12,4.57 85.95,4.57 v86.41,5.03 | v16.92,20.27 18.14,19.05 v38,19.05
D25  (via drill 0.3)
  Top 0.152: IC1.N04 36.73,35.08 v36.73,20.12 v36.73,6.55 | IC3.39 50.11,5.27 50.11,5.97 v50.7,6.55 | IC10.3 16.89,21.67 v16.92,21.64 | v85.5,6.71 86.11,7.32 86.11,19.2 85.34,19.96 83.77,19.96 X1.C4
  Bottom 0.152: v36.73,6.55 46.61,6.55 46.66,6.5 47.14,6.5 47.19,6.55 v50.7,6.55 63.35,6.55 63.4,6.5 85.29,6.5 v85.5,6.71 | v16.92,21.64 19.36,21.64 19.81,21.18 29.87,21.18 30.94,20.12 v36.73,20.12
D26  (via drill 0.3)
  Top 0.152: IC3.38 48.77,5.2 | 48.77,5.2 48.77,5.18 | 48.77,5.2 v48.77,7.62 | IC1.N03 33.68,34.57 v33.68,28.35 | v34.85,26.97 34.85,24.64 35.26,24.23 35.26,22.71 34.85,22.3 v34.85,21.03 34.85,8.53 34.75,8.43 v34.75,7.62 | v81.53,7.62 81.53,17.07 81.84,17.37 83.82,17.37 X1.B3 | IC10.4 16.84,22.94 v16.92,22.86
  Bottom 0.152: v34.75,7.62 34.8,7.57 35.76,7.57 35.81,7.62 46.53,7.62 46.58,7.67 47.14,7.67 47.24,7.57 47.8,7.57 47.85,7.62 v48.77,7.62 63.35,7.62 63.4,7.67 80.37,7.67 80.47,7.57 81.48,7.57 v81.53,7.62 | v33.68,28.35 34.85,27.18 v34.85,26.97 | v34.85,21.03 34.39,21.49 19.96,21.49 18.9,22.55 17.22,22.55 v16.92,22.86
D27  (via drill 0.3)
  Top 0.152: IC3.37 v47.52,8.15 | v35.46,8.15 35.46,22.38 35.66,22.58 35.66,24.54 35.46,24.74 v35.46,24.99 35.46,34.09 35.66,34.29 35.66,36.55 IC1.M04 | IC10.5 16.89,24.21 v16.92,24.23 | X1.C3 81.53,18.64 81.23,18.34 81.23,8.53 v80.8,8.1
  Bottom 0.152: 35.43,8.2 35.46,8.18 v35.46,8.15 45.26,8.15 45.34,8.08 47.45,8.08 v47.52,8.15 47.6,8.23 49.02,8.23 49.1,8.15 63.45,8.15 63.5,8.1 v80.8,8.1 | v16.92,24.23 17.68,24.23 18.59,23.32 23.32,23.32 23.93,23.93 25.91,23.93 27.13,25.15 35.31,25.15 v35.46,24.99
D28  (via drill 0.3)